# EAGLE design CDTV-RAM-IDE-V0.5 (EAGLE 6.6.0)

## Sheet 1 of 2
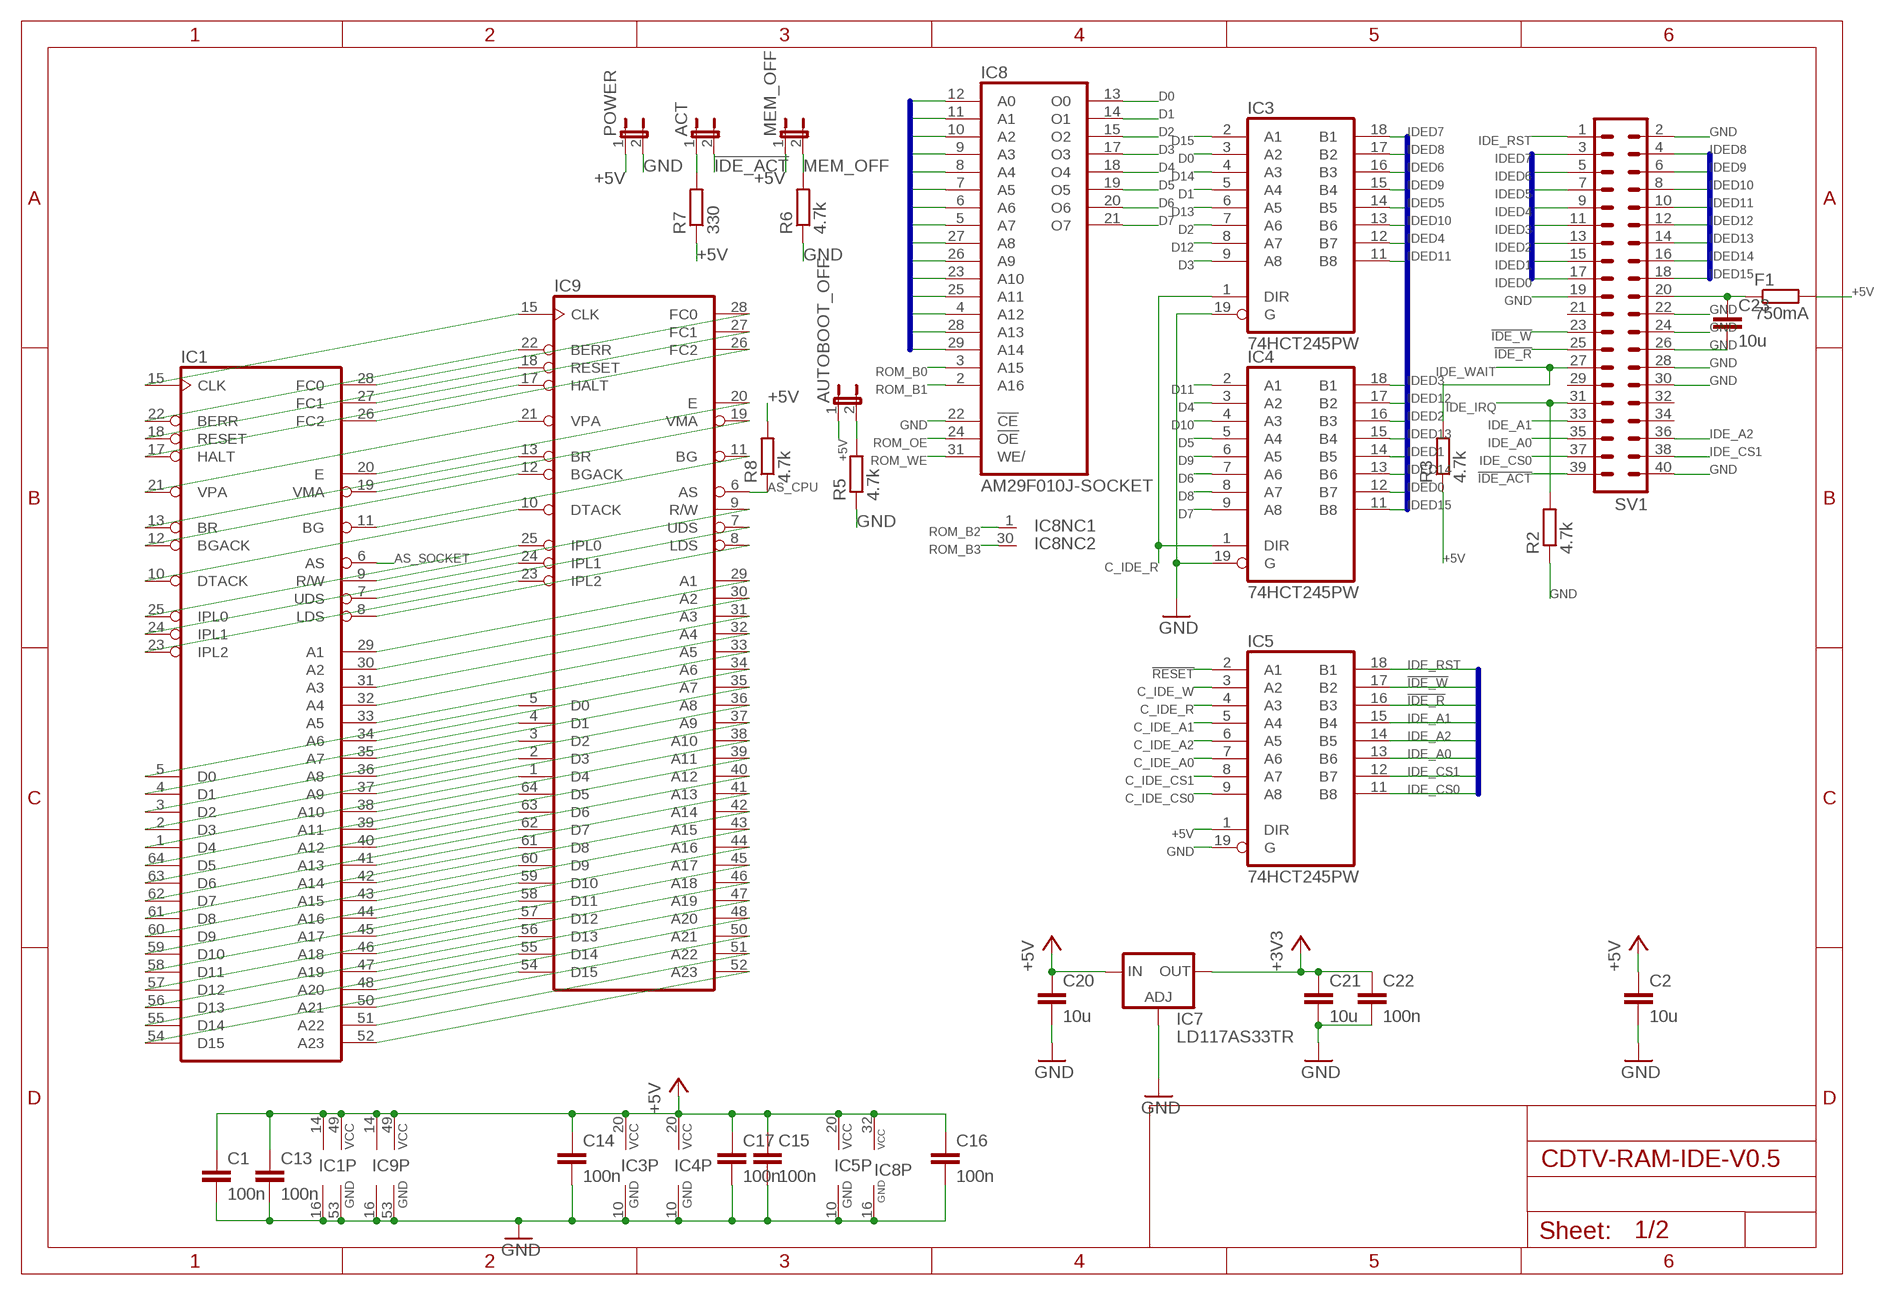
[diagram p0: schematic, sheet 1]

### Parts
ACT  JP1E  [JP1]
AUTOBOOT_OFF  JP1E  [JP1]
C1  100n  C-EUC0603K  [C0603K]
C2  10u  C-EUC0805K  [C0805K]
C13  100n  C-EUC0603K  [C0603K]
C14  100n  C-EUC0603K  [C0603K]
C15  100n  C-EUC0603K  [C0603K]
C16  100n  C-EUC0603K  [C0603K]
C17  100n  C-EUC0603K  [C0603K]
C20  10u  C-EUC0805K  [C0805K]
C21  10u  C-EUC0805K  [C0805K]
C22  100n  C-EUC0603K  [C0603K]
C23  10u  C-EUC0805K  [C0805K]
F1  750mA  R-EU_R2512  [R2512]
IC1  MC68000PROUND-PAD-BIG-HOLE  [DIL64-ROUND-BIGHOLE]
IC3  74HCT245PW  [TSSOP20]
IC4  74HCT245PW  [TSSOP20]
IC5  74HCT245PW  [TSSOP20]
IC7  LD117AS33TR  [SOT223]
IC8  AM29F010J-SOCKET  [PLCC-32-SMT-TT]
IC9  MC68000PROUND-PAD-BIG-HOLE  [DIL64-ROUND-BIGHOLE]
MEM_OFF  JP1E  [JP1]
POWER  JP1E  [JP1]
R2  4.7k  R-EU_R0603  [R0603]
R3  4.7k  R-EU_R0603  [R0603]
R5  4.7k  R-EU_R0603  [R0603]
R6  4.7k  R-EU_R0603  [R0603]
R7  330  R-EU_R0603  [R0603]
R8  4.7k  R-EU_R0603  [R0603]
SV1  ML40  [ML40]

### Nets
!BERR: IC1.22(BERR) IC9.22(BERR) ; also sheet 2
!BG: IC1.11(BG) IC9.11(BG)
!BGACK: IC1.12(BGACK) IC9.12(BGACK) ; also sheet 2
!BR: IC1.13(BR) IC9.13(BR)
!DTACK: IC1.10(DTACK) IC9.10(DTACK) ; also sheet 2
!HALT: IC1.17(HALT) IC9.17(HALT)
!IDE_ACT: ACT.2 SV1.39
!IDE_R: IC5.16(B3) SV1.25
!IDE_W: IC5.17(B2) SV1.23
!LDS: IC1.8(LDS) IC9.8(LDS) ; also sheet 2
!RESET: IC1.18(RESET) IC5.2(A1) IC9.18(RESET) ; also sheet 2
!UDS: IC1.7(UDS) IC9.7(UDS) ; also sheet 2
+3V3: C21.1 C22.1 IC7.2(OUT) IC7.4(OUT) ; also sheet 2
+5V: AUTOBOOT_OFF.1 C1.1 C2.1 C13.1 C14.1 C15.1 C16.1 C17.1 C20.1 F1.2 IC1.14(VCC) IC1.49(VCC) IC3.20(VCC) IC4.20(VCC) IC5.1(DIR) IC5.20(VCC) IC7.3(IN) IC8.32(VCC) IC9.14(VCC) IC9.49(VCC) MEM_OFF.1 POWER.1 R3.1 R7.1 R8.2 ; also sheet 2
A1: IC1.29(A1) IC8.12(A0) IC9.29(A1) ; also sheet 2
A2: IC1.30(A2) IC8.11(A1) IC9.30(A2) ; also sheet 2
A3: IC1.31(A3) IC8.10(A2) IC9.31(A3) ; also sheet 2
A4: IC1.32(A4) IC8.9(A3) IC9.32(A4) ; also sheet 2
A5: IC1.33(A5) IC8.8(A4) IC9.33(A5) ; also sheet 2
A6: IC1.34(A6) IC8.7(A5) IC9.34(A6) ; also sheet 2
A7: IC1.35(A7) IC8.6(A6) IC9.35(A7) ; also sheet 2
A8: IC1.36(A8) IC8.5(A7) IC9.36(A8) ; also sheet 2
A9: IC1.37(A9) IC8.27(A8) IC9.37(A9) ; also sheet 2
A10: IC1.38(A10) IC8.26(A9) IC9.38(A10) ; also sheet 2
A11: IC1.39(A11) IC8.23(A10) IC9.39(A11) ; also sheet 2
A12: IC1.40(A12) IC8.25(A11) IC9.40(A12) ; also sheet 2
A13: IC1.41(A13) IC8.4(A12) IC9.41(A13) ; also sheet 2
A14: IC1.42(A14) IC8.28(A13) IC9.42(A14) ; also sheet 2
A15: IC1.43(A15) IC8.29(A14) IC9.43(A15) ; also sheet 2
A16: IC1.44(A16) IC9.44(A16) ; also sheet 2
A17: IC1.45(A17) IC9.45(A17) ; also sheet 2
A18: IC1.46(A18) IC9.46(A18) ; also sheet 2
A19: IC1.47(A19) IC9.47(A19) ; also sheet 2
A20: IC1.48(A20) IC9.48(A20) ; also sheet 2
A21: IC1.50(A21) IC9.50(A21) ; also sheet 2
A22: IC1.51(A22) IC9.51(A22) ; also sheet 2
A23: IC1.52(A23) IC9.52(A23) ; also sheet 2
AS_CPU: IC9.6(AS) R8.1 ; also sheet 2
AS_SOCKET: IC1.6(AS) ; also sheet 2
AUTO_BOOT_OFF: AUTOBOOT_OFF.2 R5.2 ; also sheet 2
C_IDE_A0: IC5.7(A6) ; also sheet 2
C_IDE_A1: IC5.5(A4) ; also sheet 2
C_IDE_A2: IC5.6(A5) ; also sheet 2
C_IDE_CS0: IC5.9(A8) ; also sheet 2
C_IDE_CS1: IC5.8(A7) ; also sheet 2
C_IDE_R: IC3.1(DIR) IC4.1(DIR) IC5.4(A3) ; also sheet 2
C_IDE_W: IC5.3(A2) ; also sheet 2
CLK: IC1.15(CLK) IC9.15(CLK) ; also sheet 2
D0: IC1.5(D0) IC3.3(A2) IC8.13(O0) IC9.5(D0) ; also sheet 2
D1: IC1.4(D1) IC3.5(A4) IC8.14(O1) IC9.4(D1) ; also sheet 2
D2: IC1.3(D2) IC3.7(A6) IC8.15(O2) IC9.3(D2) ; also sheet 2
D3: IC1.2(D3) IC3.9(A8) IC8.17(O3) IC9.2(D3) ; also sheet 2
D4: IC1.1(D4) IC4.3(A2) IC8.18(O4) IC9.1(D4) ; also sheet 2
D5: IC1.64(D5) IC4.5(A4) IC8.19(O5) IC9.64(D5) ; also sheet 2
D6: IC1.63(D6) IC4.7(A6) IC8.20(O6) IC9.63(D6) ; also sheet 2
D7: IC1.62(D7) IC4.9(A8) IC8.21(O7) IC9.62(D7) ; also sheet 2
D8: IC1.61(D8) IC4.8(A7) IC9.61(D8) ; also sheet 2
D9: IC1.60(D9) IC4.6(A5) IC9.60(D9) ; also sheet 2
D10: IC1.59(D10) IC4.4(A3) IC9.59(D10) ; also sheet 2
D11: IC1.58(D11) IC4.2(A1) IC9.58(D11) ; also sheet 2
D12: IC1.57(D12) IC3.8(A7) IC9.57(D12) ; also sheet 2
D13: IC1.56(D13) IC3.6(A5) IC9.56(D13) ; also sheet 2
D14: IC1.55(D14) IC3.4(A3) IC9.55(D14) ; also sheet 2
D15: IC1.54(D15) IC3.2(A1) IC9.54(D15) ; also sheet 2
E: IC1.20(E) IC9.20(E)
FC0: IC1.28(FC0) IC9.28(FC0)
FC1: IC1.27(FC1) IC9.27(FC1)
FC2: IC1.26(FC2) IC9.26(FC2)
GND: C1.2 C2.2 C13.2 C14.2 C15.2 C16.2 C17.2 C20.2 C21.2 C22.2 C23.2 IC1.16(GND) IC1.53(GND) IC3.10(GND) IC3.19(G) IC4.10(GND) IC4.19(G) IC5.10(GND) IC5.19(G) IC7.1(ADJ) IC8.16(GND) IC8.22(!CE) IC9.16(GND) IC9.53(GND) POWER.2 R2.1 R5.1 R6.1 SV1.2 SV1.19 SV1.22 SV1.24 SV1.26 SV1.28 SV1.30 SV1.40 ; also sheet 2
IDE_A0: IC5.13(B6) SV1.35
IDE_A1: IC5.15(B4) SV1.33
IDE_A2: IC5.14(B5) SV1.36
IDE_CS0: IC5.11(B8) SV1.37
IDE_CS1: IC5.12(B7) SV1.38
IDE_IRQ: R2.2 SV1.31 ; also sheet 2
IDE_RST: IC5.18(B1) SV1.1
IDE_WAIT: R3.2 SV1.27 ; also sheet 2
IDED0: IC4.12(B7) SV1.17
IDED1: IC4.14(B5) SV1.15
IDED2: IC4.16(B3) SV1.13
IDED3: IC4.18(B1) SV1.11
IDED4: IC3.12(B7) SV1.9
IDED5: IC3.14(B5) SV1.7
IDED6: IC3.16(B3) SV1.5
IDED7: IC3.18(B1) SV1.3
IDED8: IC3.17(B2) SV1.4
IDED9: IC3.15(B4) SV1.6
IDED10: IC3.13(B6) SV1.8
IDED11: IC3.11(B8) SV1.10
IDED12: IC4.17(B2) SV1.12
IDED13: IC4.15(B4) SV1.14
IDED14: IC4.13(B6) SV1.16
IDED15: IC4.11(B8) SV1.18
IPL0: IC1.25(IPL0) IC9.25(IPL0)
IPL1: IC1.24(IPL1) IC9.24(IPL1)
IPL2: IC1.23(IPL2) IC9.23(IPL2)
KEY_PIN_POWER: C23.1 F1.1 SV1.20
MEM_OFF: MEM_OFF.2 R6.2 ; also sheet 2
N$42: ACT.1 R7.2
R/W: IC1.9(R/W) IC9.9(R/W) ; also sheet 2
ROM_B0: IC8.3(A15) ; also sheet 2
ROM_B1: IC8.2(A16) ; also sheet 2
ROM_B2: IC8.1(NC) ; also sheet 2
ROM_B3: IC8.30(NC) ; also sheet 2
ROM_OE: IC8.24(!OE) ; also sheet 2
ROM_WE: IC8.31(WE/) ; also sheet 2
VMA: IC1.19(VMA) IC9.19(VMA)
VPA: IC1.21(VPA) IC9.21(VPA)
Unconnected: SV1.21 SV1.29 SV1.32 SV1.34

### Buses
IDED[0..15]
IDE_RST,IDE_A[0..2],IDE_CS[0..1],!IDE_R,!IDE_W
A[1..23]

## Sheet 2 of 2
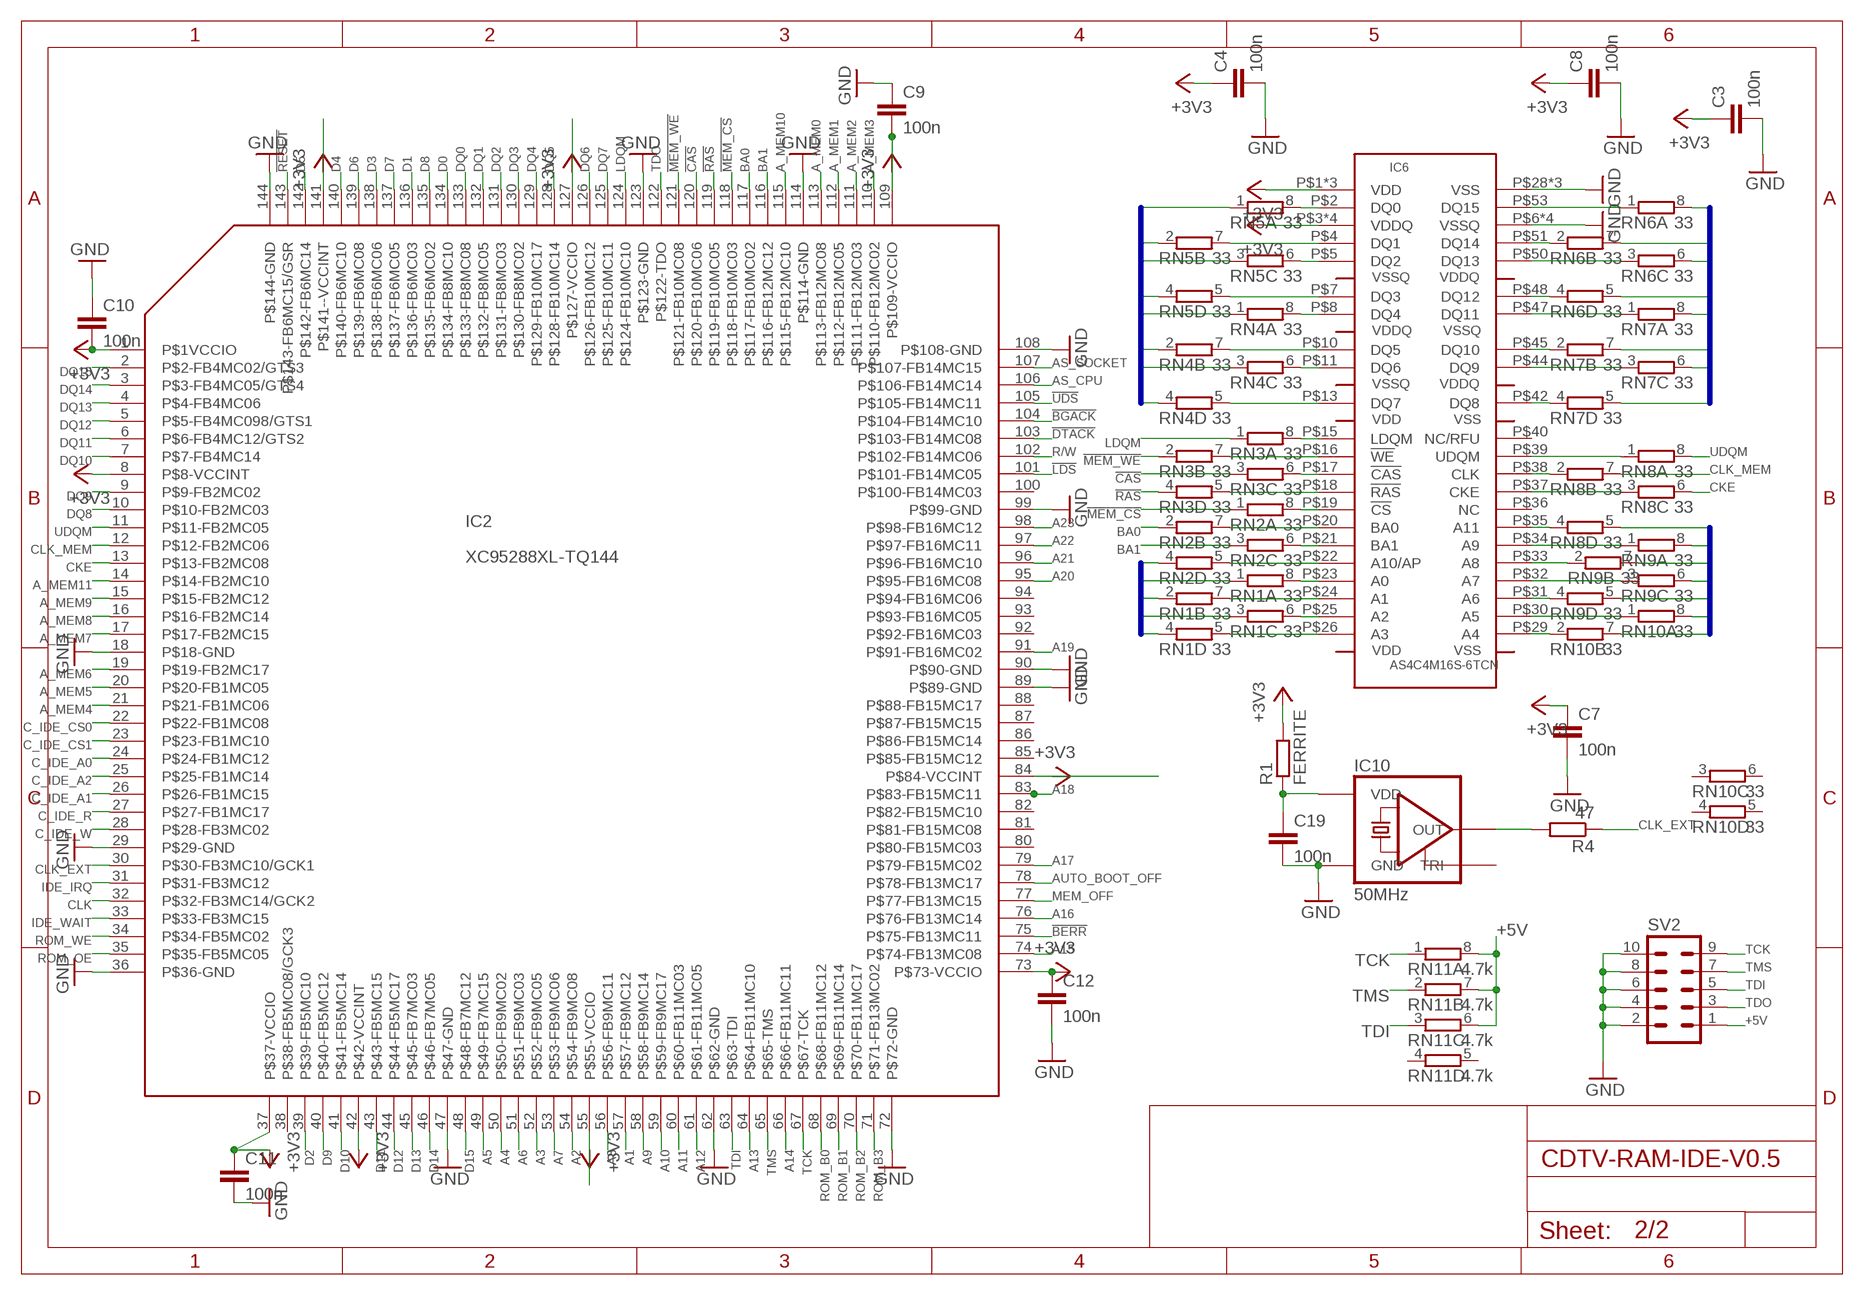
[diagram p1: schematic, sheet 2]

### Parts
C3  100n  C-EUC0603K  [C0603K]
C4  100n  C-EUC0603K  [C0603K]
C7  100n  C-EUC0603K  [C0603K]
C8  100n  C-EUC0603K  [C0603K]
C9  100n  C-EUC0603K  [C0603K]
C10  100n  C-EUC0603K  [C0603K]
C11  100n  C-EUC0603K  [C0603K]
C12  100n  C-EUC0603K  [C0603K]
C19  100n  C-EUC0603K  [C0603K]
IC2  XC95288XL-TQ144  [TQFP144]
IC6  AS4C4M16S-6TCN  [TSOP-2_54]
IC10  50MHz  CSX-750FCFC(5V)  [7X5]
R1  FERRITE  R-EU_R0603  [R0603]
R4  47  R-EU_R0603  [R0603]
RN1  33  4R-NCAY16  [CAY16]
RN2  33  4R-NCAY16  [CAY16]
RN3  33  4R-NCAY16  [CAY16]
RN4  33  4R-NCAY16  [CAY16]
RN5  33  4R-NCAY16  [CAY16]
RN6  33  4R-NCAY16  [CAY16]
RN7  33  4R-NCAY16  [CAY16]
RN8  33  4R-NCAY16  [CAY16]
RN9  33  4R-NCAY16  [CAY16]
RN10  33  4R-NCAY16  [CAY16]
RN11  4.7k  4R-NCAY16  [CAY16]
SV2  ML10L  [ML10L]

### Nets
!BERR: IC2.75(P$75-FB13MC11) ; also sheet 1
!BGACK: IC2.104(P$104-FB14MC10) ; also sheet 1
!CAS: IC2.120(P$120-FB10MC06) RN3.3
!DTACK: IC2.103(P$103-FB14MC08) ; also sheet 1
!LDS: IC2.101(P$101-FB14MC05) ; also sheet 1
!MEM_CS: IC2.118(P$118-FB10MC03) RN2.1
!MEM_WE: IC2.121(P$121-FB10MC08) RN3.2
!RAS: IC2.119(P$119-FB10MC05) RN3.4
!RESET: IC2.143(P$143-FB6MC15/GSR) ; also sheet 1
!UDS: IC2.105(P$105-FB14MC11) ; also sheet 1
+3V3: C3.1 C4.1 C7.1 C8.1 C9.2 C10.2 C11.1 C12.1 IC2.1(P$1VCCIO) IC2.8(P$8-VCCINT) IC2.37(P$37-VCCIO) IC2.42(P$42-VCCINT) IC2.55(P$55-VCCIO) IC2.73(P$73-VCCIO) IC2.84(P$84-VCCINT) IC2.109(P$109-VCCIO) IC2.127(P$127-VCCIO) IC2.141(P$141--VCCINT) IC6.P$1(VDD) IC6.P$3(VDDQ) IC6.P$9(VDDQ) IC6.P$14(VDD) IC6.P$27(VDD) IC6.P$43(VDDQ) IC6.P$49(VDDQ) R1.2 ; also sheet 1
+5V: RN11.6 RN11.7 RN11.8 SV2.1 ; also sheet 1
A1: IC2.57(P$57-FB9MC12) ; also sheet 1
A2: IC2.54(P$54-FB9MC08) ; also sheet 1
A3: IC2.52(P$52-FB9MC05) ; also sheet 1
A4: IC2.50(P$50-FB9MC02) ; also sheet 1
A5: IC2.49(P$49-FB7MC15) ; also sheet 1
A6: IC2.51(P$51-FB9MC03) ; also sheet 1
A7: IC2.53(P$53-FB9MC06) ; also sheet 1
A8: IC2.56(P$56-FB9MC11) ; also sheet 1
A9: IC2.58(P$58-FB9MC14) ; also sheet 1
A10: IC2.59(P$59-FB9MC17) ; also sheet 1
A11: IC2.60(P$60-FB11MC03) ; also sheet 1
A12: IC2.61(P$61-FB11MC05) ; also sheet 1
A13: IC2.64(P$64-FB11MC10) ; also sheet 1
A14: IC2.66(P$66-FB11MC11) ; also sheet 1
A15: IC2.74(P$74-FB13MC08) ; also sheet 1
A16: IC2.76(P$76-FB13MC14) ; also sheet 1
A17: IC2.79(P$79-FB15MC02) ; also sheet 1
A18: IC2.83(P$83-FB15MC11) ; also sheet 1
A19: IC2.91(P$91-FB16MC02) ; also sheet 1
A20: IC2.95(P$95-FB16MC08) ; also sheet 1
A21: IC2.96(P$96-FB16MC10) ; also sheet 1
A22: IC2.97(P$97-FB16MC11) ; also sheet 1
A23: IC2.98(P$98-FB16MC12) ; also sheet 1
A_MEM0: IC2.113(P$113-FB12MC08) RN1.1
A_MEM1: IC2.112(P$112-FB12MC05) RN1.2
A_MEM2: IC2.111(P$111-FB12MC03) RN1.3
A_MEM3: IC2.110(P$110-FB12MC02) RN1.4
A_MEM4: IC2.21(P$21-FB1MC06) RN10.7
A_MEM5: IC2.20(P$20-FB1MC05) RN10.8
A_MEM6: IC2.19(P$19-FB2MC17) RN9.5
A_MEM7: IC2.17(P$17-FB2MC15) RN9.6
A_MEM8: IC2.16(P$16-FB2MC14) RN9.7
A_MEM9: IC2.15(P$15-FB2MC12) RN9.8
A_MEM10: IC2.115(P$115-FB12MC10) RN2.4
A_MEM11: IC2.14(P$14-FB2MC10) RN8.5
AS_CPU: IC2.106(P$106-FB14MC14) ; also sheet 1
AS_SOCKET: IC2.107(P$107-FB14MC15) ; also sheet 1
AUTO_BOOT_OFF: IC2.78(P$78-FB13MC17) ; also sheet 1
BA0: IC2.117(P$117-FB10MC02) RN2.2
BA1: IC2.116(P$116-FB12MC12) RN2.3
C_IDE_A0: IC2.24(P$24-FB1MC12) ; also sheet 1
C_IDE_A1: IC2.26(P$26-FB1MC15) ; also sheet 1
C_IDE_A2: IC2.25(P$25-FB1MC14) ; also sheet 1
C_IDE_CS0: IC2.22(P$22-FB1MC08) ; also sheet 1
C_IDE_CS1: IC2.23(P$23-FB1MC10) ; also sheet 1
C_IDE_R: IC2.27(P$27-FB1MC17) ; also sheet 1
C_IDE_W: IC2.28(P$28-FB3MC02) ; also sheet 1
CKE: IC2.13(P$13-FB2MC08) RN8.6
CLK: IC2.32(P$32-FB3MC14/GCK2) ; also sheet 1
CLK_EXT: IC2.30(P$30-FB3MC10/GCK1) R4.1
CLK_MEM: IC2.12(P$12-FB2MC06) RN8.7
D0: IC2.134(P$134-FB8MC10) ; also sheet 1
D1: IC2.136(P$136-FB6MC03) ; also sheet 1
D2: IC2.39(P$39-FB5MC10) ; also sheet 1
D3: IC2.138(P$138-FB6MC06) ; also sheet 1
D4: IC2.140(P$140-FB6MC10) ; also sheet 1
D5: IC2.142(P$142-FB6MC14) ; also sheet 1
D6: IC2.139(P$139-FB6MC08) ; also sheet 1
D7: IC2.137(P$137-FB6MC05) ; also sheet 1
D8: IC2.135(P$135-FB6MC02) ; also sheet 1
D9: IC2.40(P$40-FB5MC12) ; also sheet 1
D10: IC2.41(P$41-FB5MC14) ; also sheet 1
D11: IC2.43(P$43-FB5MC15) ; also sheet 1
D12: IC2.44(P$44-FB5MC17) ; also sheet 1
D13: IC2.45(P$45-FB7MC03) ; also sheet 1
D14: IC2.46(P$46-FB7MC05) ; also sheet 1
D15: IC2.48(P$48-FB7MC12) ; also sheet 1
DQ0: IC2.133(P$133-FB8MC08) RN5.1
DQ1: IC2.132(P$132-FB8MC05) RN5.2
DQ2: IC2.131(P$131-FB8MC03) RN5.3
DQ3: IC2.130(P$130-FB8MC02) RN5.4
DQ4: IC2.129(P$129-FB10MC17) RN4.1
DQ5: IC2.128(P$128-FB10MC14) RN4.2
DQ6: IC2.126(P$126-FB10MC12) RN4.3
DQ7: IC2.125(P$125-FB10MC11) RN4.4
DQ8: IC2.10(P$10-FB2MC03) RN7.5
DQ9: IC2.9(P$9-FB2MC02) RN7.6
DQ10: IC2.7(P$7-FB4MC14) RN7.7
DQ11: IC2.6(P$6-FB4MC12/GTS2) RN7.8
DQ12: IC2.5(P$5-FB4MC098/GTS1) RN6.5
DQ13: IC2.4(P$4-FB4MC06) RN6.6
DQ14: IC2.3(P$3-FB4MC05/GTS4) RN6.7
DQ15: IC2.2(P$2-FB4MC02/GTS3) RN6.8
GND: C3.2 C4.2 C7.2 C8.2 C9.1 C10.1 C11.2 C12.2 C19.2 IC2.18(P$18-GND) IC2.29(P$29-GND) IC2.36(P$36-GND) IC2.47(P$47-GND) IC2.62(P$62-GND) IC2.72(P$72-GND) IC2.89(P$89-GND) IC2.90(P$90-GND) IC2.99(P$99-GND) IC2.108(P$108-GND) IC2.114(P$114-GND) IC2.123(P$123-GND) IC2.144(P$144-GND) IC6.P$6(VSSQ) IC6.P$12(VSSQ) IC6.P$28(VSS) IC6.P$41(VSS) IC6.P$46(VSSQ) IC6.P$52(VSSQ) IC6.P$54(VSS) IC10.P$2(GND) SV2.2 SV2.4 SV2.6 SV2.8 SV2.10 ; also sheet 1
IDE_IRQ: IC2.31(P$31-FB3MC12) ; also sheet 1
IDE_WAIT: IC2.33(P$33-FB3MC15) ; also sheet 1
LDQM: IC2.124(P$124-FB10MC10) RN3.1
MEM_OFF: IC2.77(P$77-FB13MC15) ; also sheet 1
N$1: IC6.P$26(A3) RN1.5
N$2: IC6.P$25(A2) RN1.6
N$3: IC6.P$24(A1) RN1.7
N$4: IC6.P$23(A0) RN1.8
N$5: IC6.P$22(A10/AP) RN2.5
N$6: IC6.P$21(BA1) RN2.6
N$7: IC6.P$20(BA0) RN2.7
N$8: IC6.P$19(!CS) RN2.8
N$9: IC6.P$18(!RAS) RN3.5
N$10: IC6.P$17(!CAS) RN3.6
N$11: IC6.P$16(!WE) RN3.7
N$12: IC6.P$15(LDQM) RN3.8
N$13: IC6.P$13(DQ7) RN4.5
N$14: IC6.P$11(DQ6) RN4.6
N$15: IC6.P$10(DQ5) RN4.7
N$16: IC6.P$8(DQ4) RN4.8
N$17: IC6.P$7(DQ3) RN5.5
N$18: IC6.P$5(DQ2) RN5.6
N$19: IC6.P$4(DQ1) RN5.7
N$20: IC6.P$2(DQ0) RN5.8
N$21: IC6.P$53(DQ15) RN6.1
N$22: IC6.P$51(DQ14) RN6.2
N$23: IC6.P$50(DQ13) RN6.3
N$24: IC6.P$48(DQ12) RN6.4
N$25: IC6.P$47(DQ11) RN7.1
N$26: IC6.P$45(DQ10) RN7.2
N$27: IC6.P$44(DQ9) RN7.3
N$28: IC6.P$42(DQ8) RN7.4
N$29: IC6.P$39(UDQM) RN8.1
N$30: IC6.P$38(CLK) RN8.2
N$31: IC6.P$37(CKE) RN8.3
N$32: IC6.P$35(A11) RN8.4
N$33: IC6.P$34(A9) RN9.1
N$34: IC6.P$33(A8) RN9.2
N$35: IC6.P$32(A7) RN9.3
N$36: IC6.P$31(A6) RN9.4
N$37: IC6.P$30(A5) RN10.1
N$38: IC6.P$29(A4) RN10.2
N$39: IC10.P$3(OUT) R4.2
R/W: IC2.102(P$102-FB14MC06) ; also sheet 1
ROM_B0: IC2.68(P$68-FB11MC12) ; also sheet 1
ROM_B1: IC2.69(P$69-FB11MC14) ; also sheet 1
ROM_B2: IC2.70(P$70-FB11MC17) ; also sheet 1
ROM_B3: IC2.71(P$71-FB13MC02) ; also sheet 1
ROM_OE: IC2.35(P$35-FB5MC05) ; also sheet 1
ROM_WE: IC2.34(P$34-FB5MC02) ; also sheet 1
TCK: IC2.67(P$67-TCK) RN11.1 SV2.9
TDI: IC2.63(P$63-TDI) RN11.3 SV2.5
TDO: IC2.122(P$122-TDO) SV2.3
TMS: IC2.65(P$65-TMS) RN11.2 SV2.7
UDQM: IC2.11(P$11-FB2MC05) RN8.8
VCC-X: C19.1 IC10.P$4(VDD) R1.1
Unconnected: IC2.38(P$38-FB5MC08/GCK3) IC2.80(P$80-FB15MC03) IC2.81(P$81-FB15MC08) IC2.82(P$82-FB15MC10) IC2.85(P$85-FB15MC12) IC2.86(P$86-FB15MC14) IC2.87(P$87-FB15MC15) IC2.88(P$88-FB15MC17) IC2.92(P$92-FB16MC03) IC2.93(P$93-FB16MC05) IC2.94(P$94-FB16MC06) IC2.100(P$100-FB14MC03) IC6.P$36(NC) IC6.P$40(NC/RFU) IC10.P$1(TRI) RN10.3 RN10.4 RN10.5 RN10.6 RN11.4 RN11.5

### Buses
DQ[0..15]
A_MEM[0..11]

## Library data of the parts
ACT AUTOBOOT_OFF MEM_OFF POWER = jumper:JP1E: JUMPER
C1-C4 C7-C17 C19-C23 = rcl:C-EU: CAPACITOR, European symbol
F1 R1-R8 = rcl:R-EU_: RESISTOR, European symbol
IC1 IC9 = micro-mc68000:MC68000P: 68xxx PROCESSOR
IC2 = xilinx_xc9572xl-tq100:XC95288XL-TQ144
IC3-IC5 = 74xx-eu:74*245: Octal BUS TRANSCEIVER, 3-state
IC6 = Alliance_Memory_By_element14_Batch_1:AS4C4M16S-6TCN
IC7 = v-reg:LD117A?*: Low drop fixed and adjustable positive voltage regulators 1 A Source: http://www.st.com/stonline/products/literature/ds/7194/ld1117axx.pdf
IC8 = am29-memory:AM29F010*: 1-Megabit FLASH MEMORY (128 K x 8 bit) 5 V-only
IC10 = SMD-Crystal:CSX-750FC: CITIZEN Crystal Clock Oscilator from http://cfm.citizen.co.jp/english/product/pdf/CSX-750F.pdf
RN1-RN11 = resistor-dil:4R-N: Array Chip Resistor Source: RS Component / Phycomp; OC_FARNELL: unknown; OC_NEWARK: unknown
SV1 = con-harting-ml:ML40: HARTING; OC_FARNELL: unknown; OC_NEWARK: unknown
SV2 = con-harting-ml:ML10: HARTING; OC_FARNELL: unknown; OC_NEWARK: unknown

## Board
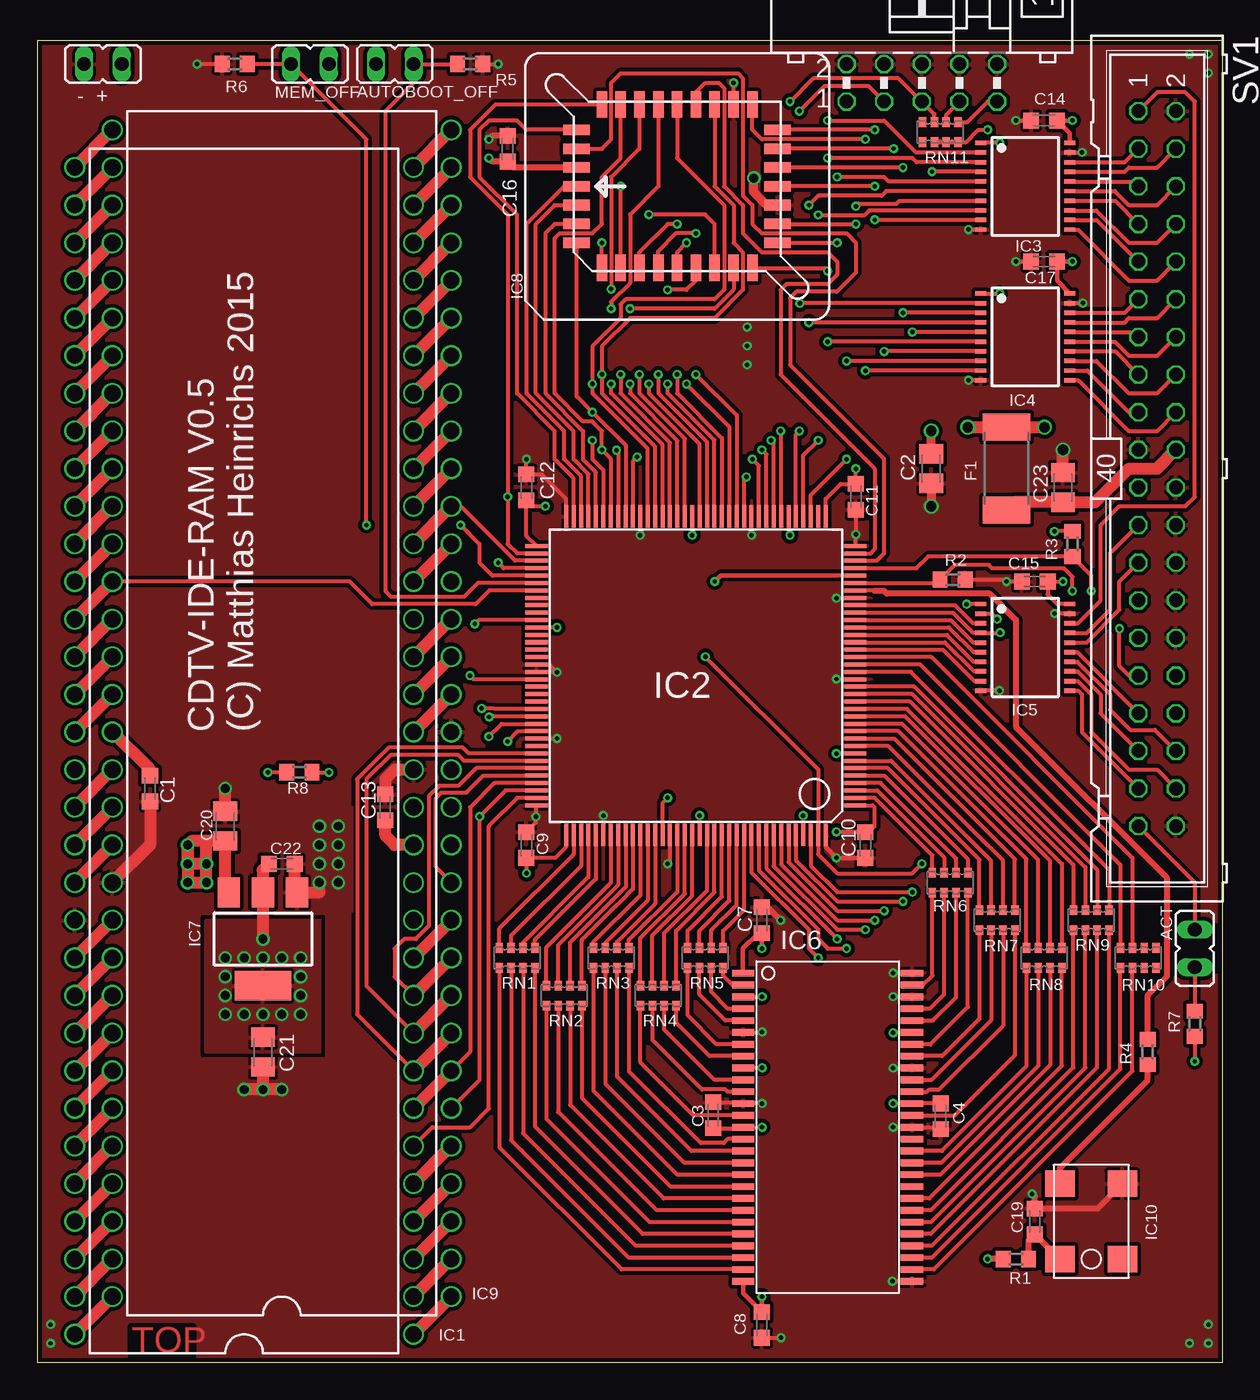
[diagram p2: board, top side]
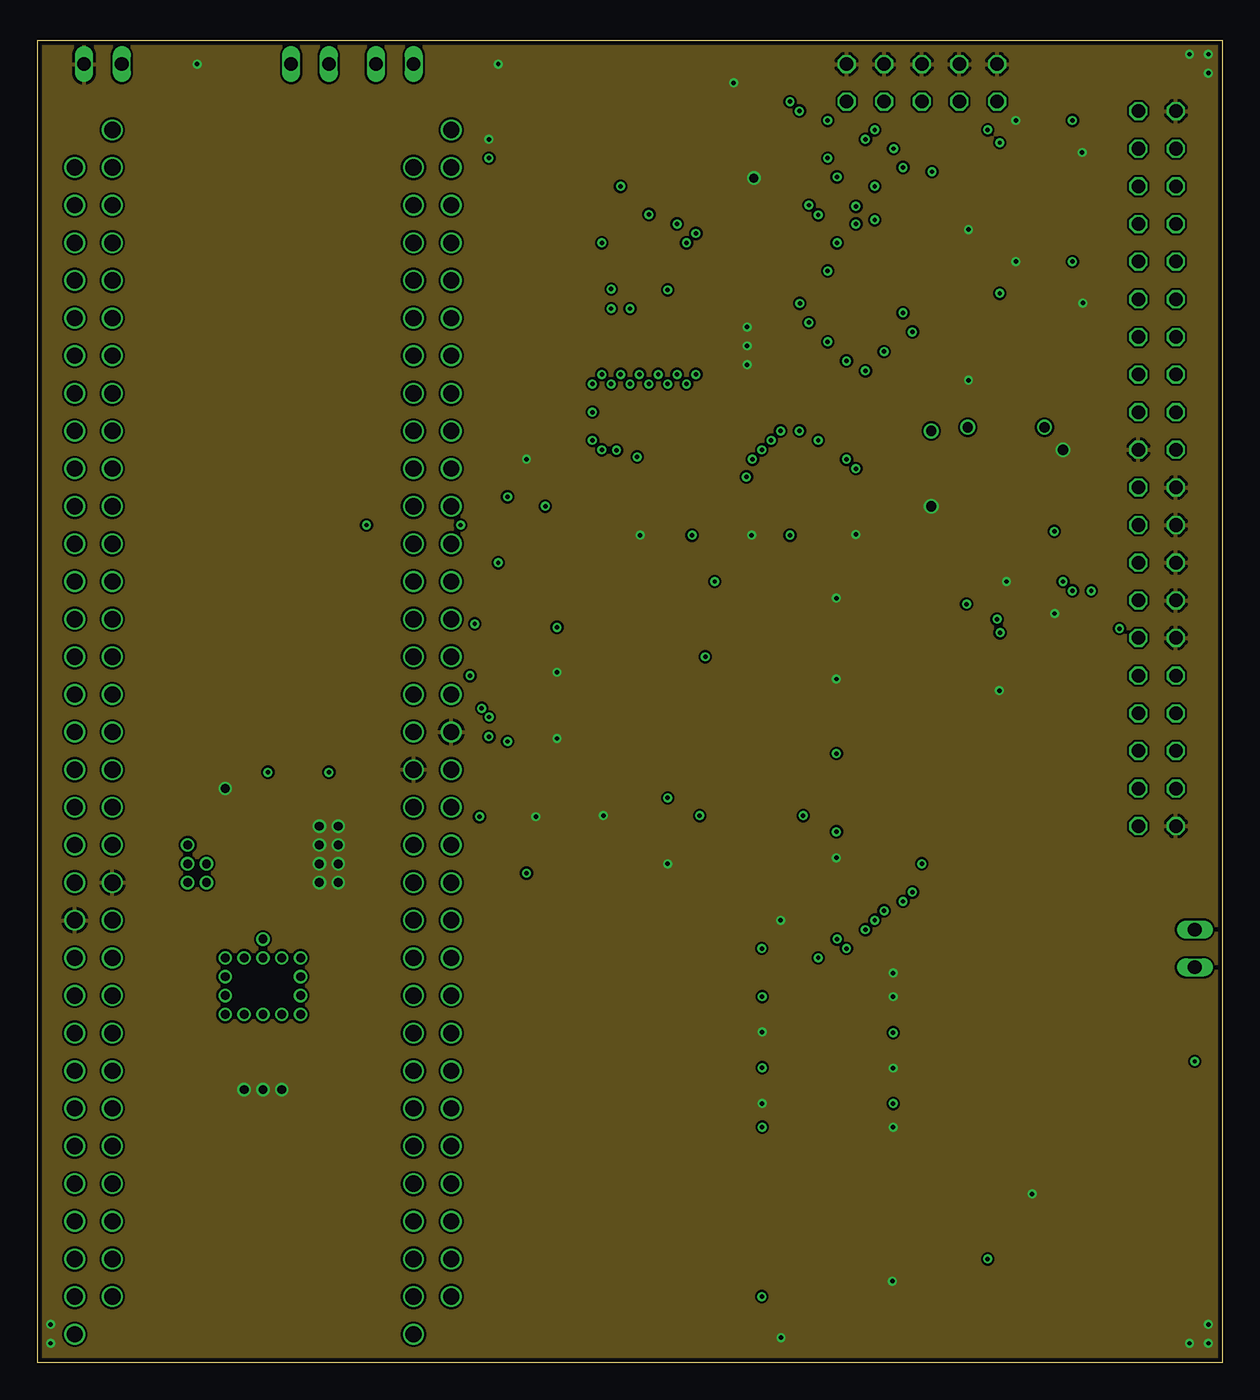
[diagram p3: board, inner layer Route2]
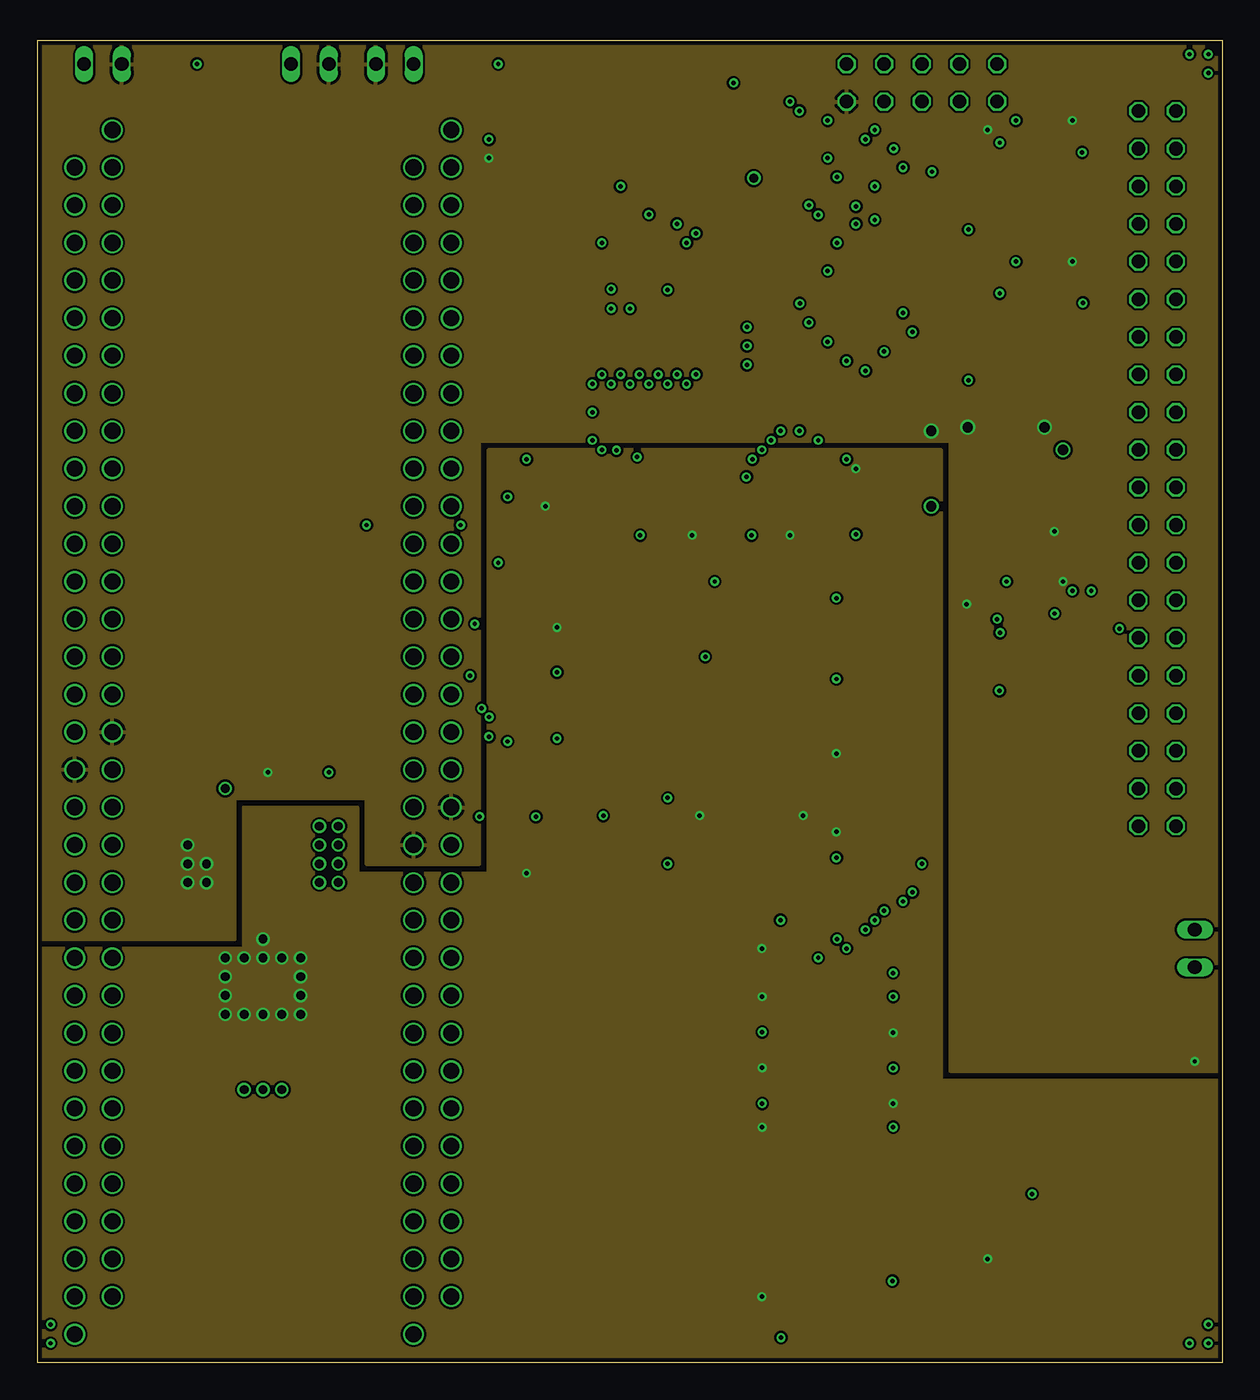
[diagram p4: board, inner layer Route15]
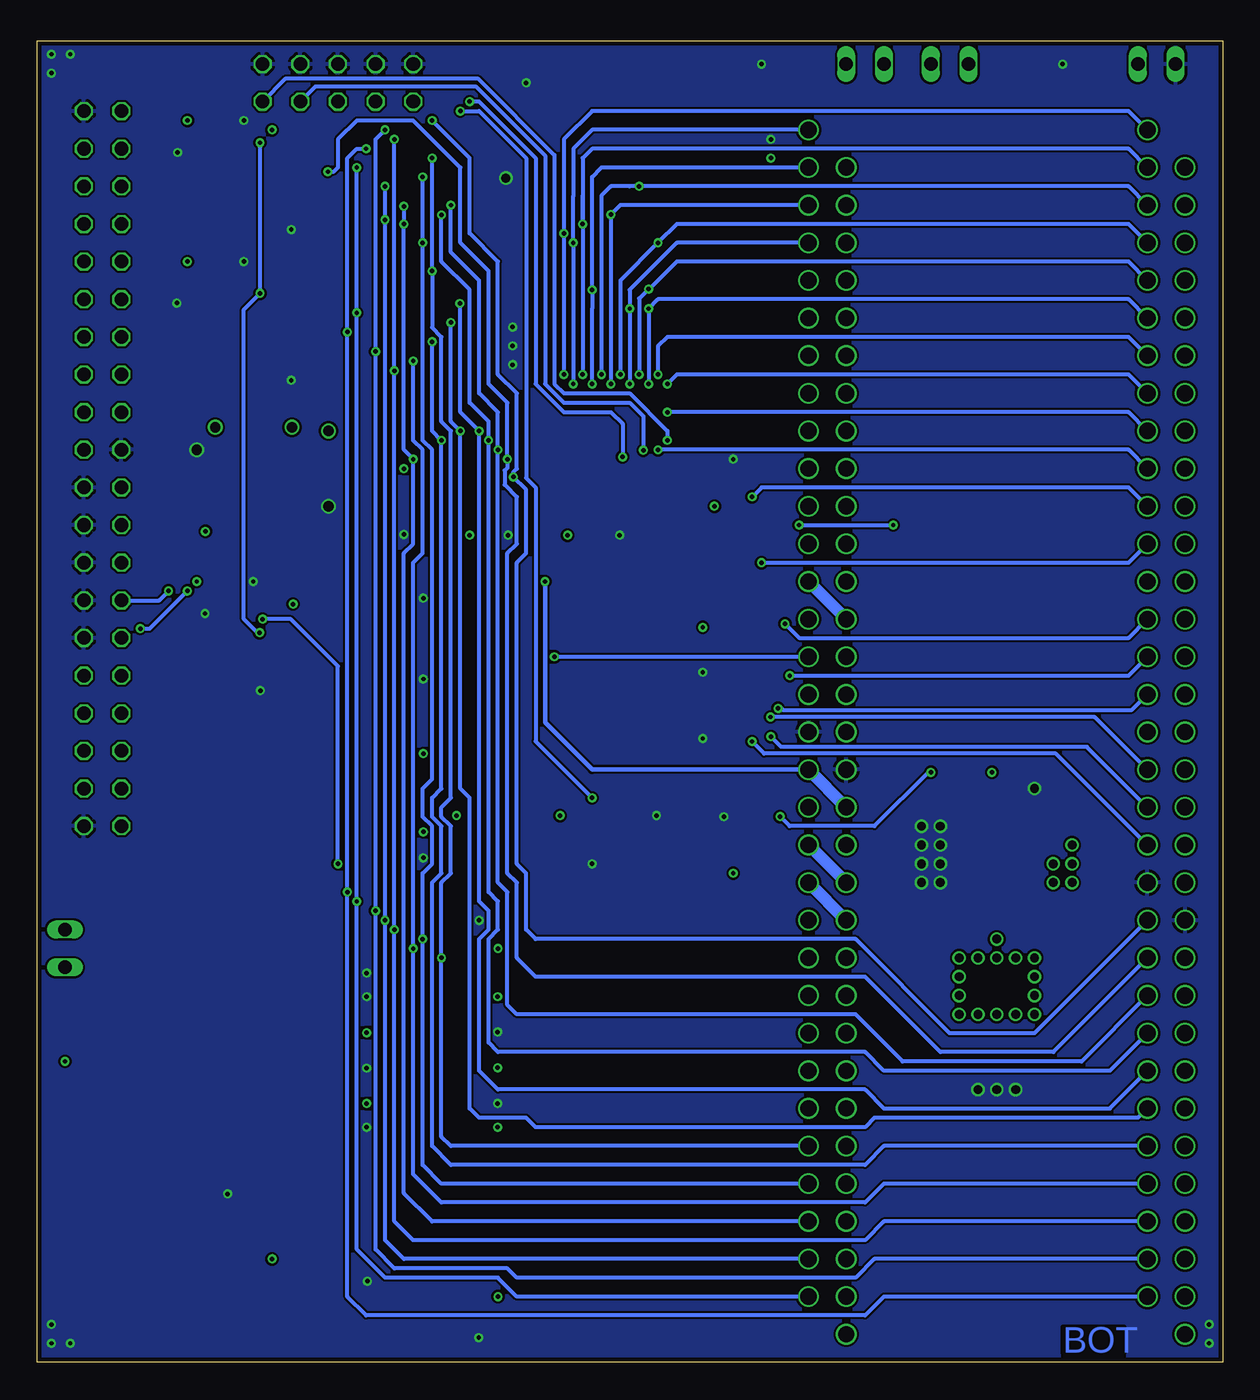
[diagram p5: board, bottom side, seen from below]

Size 79.99 x 89.2 mm. Coordinates in mm from the lower left corner, seen from the top.
Outline: 0,0 79.99,0 79.99,89.2 0,89.2 0,0
Copper layers (1+2*15+16): Top 0.035mm / dielectric 0.36mm / Route2 0.035mm / dielectric 0.71mm / Route15 0.035mm / dielectric 0.36mm / Bottom 0.035mm
Design rules "LeitOn - Standard-Eagle-DRU - 4-Lagen Multilayer - deutsch - Rev 2.0 *": minimum track width 0.15mm, minimum drill 0.3mm, track to track 0.15mm, track to pad 0.15mm, pad to pad 0.15mm, via to via 0.15mm, smd to smd 0.15mm, copper to edge 0.3mm, drill to drill 0.3mm, minimum pad ring 0.15mm, minimum via ring 0.15mm, stop-mask expansion 0.075mm, vias tented up to drill 0mil, thermal gap 0.2mm

### Footprints (pad centres in the part's own frame; a part is rotated, then mirrored left to right if it is on the bottom)
JP1 = drill 0.914 long: 1 0,-1.27; 2 0,1.27
C0603K = smd 1.05 x 1.08: 1 -0.875,0; 2 0.875,0
C0805K = smd 1.3 x 1.6: 1 -1,0; 2 1,0
R2512 = smd 1.8 x 3.2: 1 -2.8,0; 2 2.8,0
DIL64-ROUND-BIGHOLE = drill 1.1: 1 -38.1,-11.43; 2 -35.56,-11.43; 3 -33.02,-11.43; 4 -30.48,-11.43; 5 -27.94,-11.43; 6 -25.4,-11.43; 7 -22.86,-11.43; 8 -20.32,-11.43; 9 -17.78,-11.43; 10 -15.24,-11.43; 11 -12.7,-11.43; 12 -10.16,-11.43; 13 -7.62,-11.43; 14 -5.08,-11.43; 15 -2.54,-11.43; 16 0,-11.43; 17 2.54,-11.43; 18 5.08,-11.43; 19 7.62,-11.43; 20 10.16,-11.43; 21 12.7,-11.43; 22 15.24,-11.43; 23 17.78,-11.43; 24 20.32,-11.43; 25 22.86,-11.43; 26 25.4,-11.43; 27 27.94,-11.43; 28 30.48,-11.43; 29 33.02,-11.43; 30 35.56,-11.43; 31 38.1,-11.43; 32 40.64,-11.43; 33 40.64,11.43; 34 38.1,11.43; 35 35.56,11.43; 36 33.02,11.43; 37 30.48,11.43; 38 27.94,11.43; 39 25.4,11.43; 40 22.86,11.43; 41 20.32,11.43; 42 17.78,11.43; 43 15.24,11.43; 44 12.7,11.43; 45 10.16,11.43; 46 7.62,11.43; 47 5.08,11.43; 48 2.54,11.43; 49 0,11.43; 50 -2.54,11.43; 51 -5.08,11.43; 52 -7.62,11.43; 53 -10.16,11.43; 54 -12.7,11.43; 55 -15.24,11.43; 56 -17.78,11.43; 57 -20.32,11.43; 58 -22.86,11.43; 59 -25.4,11.43; 60 -27.94,11.43; 61 -30.48,11.43; 62 -33.02,11.43; 63 -35.56,11.43; 64 -38.1,11.43
TQFP144 = smd 0.27 x 1.5: 1 -8.75,-10.75; 2 -8.25,-10.75; 3 -7.75,-10.75; 4 -7.25,-10.75; 5 -6.75,-10.75; 6 -6.25,-10.75; 7 -5.75,-10.75; 8 -5.25,-10.75; 9 -4.75,-10.75; 10 -4.25,-10.75; 11 -3.75,-10.75; 12 -3.25,-10.75; 13 -2.75,-10.75; 14 -2.25,-10.75; 15 -1.75,-10.75; 16 -1.25,-10.75; 17 -0.75,-10.75; 18 -0.25,-10.75; 19 0.25,-10.75; 20 0.75,-10.75; 21 1.25,-10.75; 22 1.75,-10.75; 23 2.25,-10.75; 24 2.75,-10.75; 25 3.25,-10.75; 26 3.75,-10.75; 27 4.25,-10.75; 28 4.75,-10.75; 29 5.25,-10.75; 30 5.75,-10.75; 31 6.25,-10.75; 32 6.75,-10.75; 33 7.25,-10.75; 34 7.75,-10.75; 35 8.25,-10.75; 36 8.75,-10.75; 73 8.75,10.75; 74 8.25,10.75; 75 7.75,10.75; 76 7.25,10.75; 77 6.75,10.75; 78 6.25,10.75; 79 5.75,10.75; 80 5.25,10.75; 81 4.75,10.75; 82 4.25,10.75; 83 3.75,10.75; 84 3.25,10.75; 85 2.75,10.75; 86 2.25,10.75; 87 1.75,10.75; 88 1.25,10.75; 89 0.75,10.75; 90 0.25,10.75; 91 -0.25,10.75; 92 -0.75,10.75; 93 -1.25,10.75; 94 -1.75,10.75; 95 -2.25,10.75; 96 -2.75,10.75; 97 -3.25,10.75; 98 -3.75,10.75; 99 -4.25,10.75; 100 -4.75,10.75; 101 -5.25,10.75; 102 -5.75,10.75; 103 -6.25,10.75; 104 -6.75,10.75; 105 -7.25,10.75; 106 -7.75,10.75; 107 -8.25,10.75; 108 -8.75,10.75 | smd 1.5 x 0.27: 37 10.75,-8.75; 38 10.75,-8.25; 39 10.75,-7.75; 40 10.75,-7.25; 41 10.75,-6.75; 42 10.75,-6.25; 43 10.75,-5.75; 44 10.75,-5.25; 45 10.75,-4.75; 46 10.75,-4.25; 47 10.75,-3.75; 48 10.75,-3.25; 49 10.75,-2.75; 50 10.75,-2.25; 51 10.75,-1.75; 52 10.75,-1.25; 53 10.75,-0.75; 54 10.75,-0.25; 55 10.75,0.25; 56 10.75,0.75; 57 10.75,1.25; 58 10.75,1.75; 59 10.75,2.25; 60 10.75,2.75; 61 10.75,3.25; 62 10.75,3.75; 63 10.75,4.25; 64 10.75,4.75; 65 10.75,5.25; 66 10.75,5.75; 67 10.75,6.25; 68 10.75,6.75; 69 10.75,7.25; 70 10.75,7.75; 71 10.75,8.25; 72 10.75,8.75; 109 -10.75,8.75; 110 -10.75,8.25; 111 -10.75,7.75; 112 -10.75,7.25; 113 -10.75,6.75; 114 -10.75,6.25; 115 -10.75,5.75; 116 -10.75,5.25; 117 -10.75,4.75; 118 -10.75,4.25; 119 -10.75,3.75; 120 -10.75,3.25; 121 -10.75,2.75; 122 -10.75,2.25; 123 -10.75,1.75; 124 -10.75,1.25; 125 -10.75,0.75; 126 -10.75,0.25; 127 -10.75,-0.25; 128 -10.75,-0.75; 129 -10.75,-1.25; 130 -10.75,-1.75; 131 -10.75,-2.25; 132 -10.75,-2.75; 133 -10.75,-3.25; 134 -10.75,-3.75; 135 -10.75,-4.25; 136 -10.75,-4.75; 137 -10.75,-5.25; 138 -10.75,-5.75; 139 -10.75,-6.25; 140 -10.75,-6.75; 141 -10.75,-7.25; 142 -10.75,-7.75; 143 -10.75,-8.25; 144 -10.75,-8.75
TSSOP20 = smd 0.3 x 0.75: 1 -2.925,-3; 2 -2.275,-3; 3 -1.625,-3; 4 -0.975,-3; 5 -0.325,-3; 6 0.325,-3; 7 0.975,-3; 8 1.625,-3; 9 2.275,-3; 10 2.925,-3; 11 2.925,3; 12 2.275,3; 13 1.625,3; 14 0.975,3; 15 0.325,3; 16 -0.325,3; 17 -0.975,3; 18 -1.625,3; 19 -2.275,3; 20 -2.925,3
TSOP-2_54 = smd 1.51 x 0.458: P$1 -5.7,10.4; P$2 -5.7,9.6; P$3 -5.7,8.8; P$4 -5.7,8; P$5 -5.7,7.2; P$6 -5.7,6.4; P$7 -5.7,5.6; P$8 -5.7,4.8; P$9 -5.7,4; P$10 -5.7,3.2; P$11 -5.7,2.4; P$12 -5.7,1.6; P$13 -5.7,0.8; P$14 -5.7,0; P$15 -5.7,-0.8; P$16 -5.7,-1.6; P$17 -5.7,-2.4; P$18 -5.7,-3.2; P$19 -5.7,-4; P$20 -5.7,-4.8; P$21 -5.7,-5.6; P$22 -5.7,-6.4; P$23 -5.7,-7.2; P$24 -5.7,-8; P$25 -5.7,-8.8; P$26 -5.7,-9.6; P$27 -5.7,-10.4; P$28 5.7,-10.4; P$29 5.7,-9.6; P$30 5.7,-8.8; P$31 5.7,-8; P$32 5.7,-7.2; P$33 5.7,-6.4; P$34 5.7,-5.6; P$35 5.7,-4.8; P$36 5.7,-4; P$37 5.7,-3.2; P$38 5.7,-2.4; P$39 5.7,-1.6; P$40 5.7,-0.8; P$41 5.7,0; P$42 5.7,0.8; P$43 5.7,1.6; P$44 5.7,2.4; P$45 5.7,3.2; P$46 5.7,4; P$47 5.7,4.8; P$48 5.7,5.6; P$49 5.7,6.4; P$50 5.7,7.2; P$51 5.7,8; P$52 5.7,8.8; P$53 5.7,9.6; P$54 5.7,10.4
SOT223 = smd 1.5 x 2: 1 -2.3,-3.15; 2 0,-3.15; 3 2.3,-3.15 | smd 3.8 x 2: 4 0,3.15
PLCC-32-SMT-TT = smd 0.71 x 1.78: 1 0,6.785; 2 -1.27,6.785; 3 -2.54,6.785; 4 -3.81,6.785; 14 -3.81,-6.785; 15 -2.54,-6.785; 16 -1.27,-6.785; 17 0,-6.785; 18 1.27,-6.785; 19 2.54,-6.785; 20 3.81,-6.785; 30 3.81,6.785; 31 2.54,6.785; 32 1.27,6.785 | smd 1.78 x 0.71: 5 -5.515,5.08; 6 -5.515,3.81; 7 -5.515,2.54; 8 -5.515,1.27; 9 -5.515,0; 10 -5.515,-1.27; 11 -5.515,-2.54; 12 -5.515,-3.81; 13 -5.515,-5.08; 21 5.515,-5.08; 22 5.515,-3.81; 23 5.515,-2.54; 24 5.515,-1.27; 25 5.515,0; 26 5.515,1.27; 27 5.515,2.54; 28 5.515,3.81; 29 5.515,5.08
7X5 = smd 1.8 x 2: P$1 -2.54,-2.1; P$2 2.54,-2.1; P$3 2.54,2.1; P$4 -2.54,2.1
R0603 = smd 1 x 1.1: 1 -0.85,0; 2 0.85,0
CAY16 = smd 0.5 x 0.65: 1 -1.2,-0.675; 2 -0.4,-0.675; 3 0.4,-0.675; 4 1.2,-0.675; 5 1.2,0.675; 6 0.4,0.675; 7 -0.4,0.675; 8 -1.2,0.675
ML40 = drill 0.914 octagon: 1 -24.13,-1.27; 2 -24.13,1.27; 3 -21.59,-1.27; 4 -21.59,1.27; 5 -19.05,-1.27; 6 -19.05,1.27; 7 -16.51,-1.27; 8 -16.51,1.27; 9 -13.97,-1.27; 10 -13.97,1.27; 11 -11.43,-1.27; 12 -11.43,1.27; 13 -8.89,-1.27; 14 -8.89,1.27; 15 -6.35,-1.27; 16 -6.35,1.27; 17 -3.81,-1.27; 18 -3.81,1.27; 19 -1.27,-1.27; 20 -1.27,1.27; 21 1.27,-1.27; 22 1.27,1.27; 23 3.81,-1.27; 24 3.81,1.27; 25 6.35,-1.27; 26 6.35,1.27; 27 8.89,-1.27; 28 8.89,1.27; 29 11.43,-1.27; 30 11.43,1.27; 31 13.97,-1.27; 32 13.97,1.27; 33 16.51,-1.27; 34 16.51,1.27; 35 19.05,-1.27; 36 19.05,1.27; 37 21.59,-1.27; 38 21.59,1.27; 39 24.13,-1.27; 40 24.13,1.27
ML10L = drill 0.914 octagon: 1 -5.08,-1.27; 2 -5.08,1.27; 3 -2.54,-1.27; 4 -2.54,1.27; 5 0,-1.27; 6 0,1.27; 7 2.54,-1.27; 8 2.54,1.27; 9 5.08,-1.27; 10 5.08,1.27

### Placement (x,y rotation side)
ACT  78.11,27.94 0 top
AUTOBOOT_OFF  24.13,87.63 270 top
C1  7.62,38.73 270 top
C2  60.33,60.33 270 top
C3  45.62,16.69 90 top
C4  60.96,16.61 270 top
C7  48.9,29.84 90 top
C8  48.9,2.54 270 top
C9  33.02,34.93 270 top
C10  55.88,34.93 90 top
C11  55.24,58.42 270 top
C12  33.02,59.05 90 top
C13  23.5,37.47 90 top
C14  67.94,83.82 180 top
C15  67.31,52.71 180 top
C16  31.75,81.91 90 top
C17  67.94,74.3 180 top
C19  67.31,9.53 90 top
C20  12.7,36.2 90 top
C21  15.24,20.95 270 top
C22  16.51,33.66 0 top
C23  69.22,59.05 90 top
F1  65.41,60.33 90 top
IC1  13.97,40.01 90 top
IC2  44.45,46.36 90 top
IC3  66.67,79.38 270 top
IC4  66.67,69.21 270 top
IC5  66.67,48.26 270 top
IC6  53.34,15.88 0 top
IC7  15.24,28.57 180 top
IC8  43.18,79.38 90 top
IC9  16.51,42.55 90 top
IC10  71.12,9.53 90 top
MEM_OFF  18.41,87.63 90 top
POWER  4.45,87.63 90 top
R1  66.04,6.99 180 top
R2  61.77,52.83 180 top
R3  69.85,55.25 270 top
R4  74.93,20.95 270 top
R5  29.21,87.63 180 top
R6  13.34,87.63 0 top
R7  78.11,22.86 90 top
R8  17.7,39.83 180 top
RN1  32.38,27.3 180 top
RN2  35.56,24.76 180 top
RN3  38.73,27.3 180 top
RN4  41.91,24.76 180 top
RN5  45.09,27.3 180 top
RN6  61.59,32.39 0 top
RN7  64.77,29.84 0 top
RN8  67.94,27.3 0 top
RN9  71.12,29.84 0 top
RN10  74.3,27.3 0 top
RN11  60.93,83.03 180 top
SV1  75.56,60.33 270 top
SV2  59.69,86.36 0 top

### Tracks (layer width: path | path; a pad name or v marks a point on that pad's centre or on a via)
!BERR
  Top 0.254: IC2.75 32.26,54.11 28.57,57.79 IC9.22
  Top 0.813: IC1.22 IC9.22
!BG
  Top 0.813: IC1.11 IC9.11
!BGACK
  Top 0.254: IC9.12 26.9,33.43 26.9,38.08 27.28,38.46 28.96,38.46 30.11,39.61 IC2.104
  Bottom 0.813: IC1.12 IC9.12
!BR
  Bottom 0.813: IC1.13 IC9.13
!CAS
  Top 0.254: RN3.3 38.34,28.3 41.2,31.17 IC2.120
!DTACK
  Top 0.254: IC2.103 29.61,40.11 28.42,38.91 27.13,38.91 26.44,38.23 26.44,29.46 25.55,28.57 24.77,28.57 24.13,27.94 24.13,26.04 IC1.10
  Top 0.813: IC1.10 IC9.10
!HALT
  Top 0.813: IC1.17 IC9.17
!IDE_ACT
  Top 0.254: SV1.39 78.11,32.39 ACT.2
!IDE_R
  Top 0.254: IC5.16 70.81,48.59 73.03,50.8 73.03,52.71 SV1.25
!IDE_W
  Top 0.254: IC5.17 70.83,49.23 72.39,50.8 72.39,54.61 SV1.23
!LDS
  Top 0.254: IC2.101 29.13,41.11 28.73,41.5 23.72,41.5 21.59,39.37 21.59,23.49 IC1.8
  Top 0.813: IC1.8 IC9.8
!MEM_CS
  Top 0.254: RN2.1 36.76,28.5 39.05,30.8 39.37,31.11 40.2,31.94 IC2.118
!MEM_WE
  Top 0.254: RN3.2 39.13,28.39 41.7,30.96 IC2.121
!RAS
  Top 0.254: RN3.4 37.53,28.37 40.7,31.53 IC2.119
!RESET  (via drill 0.3)
  Top 0.254: v59.69,33.66 59.05,33.02 53.98,33.02 52.7,34.3 IC2.143 52.7,40.01 v45.09,47.62 | IC5.2 64.4,50.54 v64.77,50.16
  Top 0.813: IC1.18 IC9.18
  Bottom 0.254: v59.69,33.66 59.69,46.99 62.87,50.16 v64.77,50.16 | IC9.18 v45.09,47.62
!UDS
  Top 0.254: IC2.105 30.85,39.11 29.21,37.47 29.21,20.95 IC9.7
  Top 0.813: IC1.7 IC9.7
+3V3  (via drill 0.3, 0.6)
  Top 0.254: IC6.P$49 59.02,22.25 v57.76,22.25 | IC6.P$1 47.62,26.27 | v48.92,15.88 IC6.P$14 47.58,15.81 C3.1 | v48.92,19.89 47.65,19.89 IC6.P$9 | v57.76,17.47 IC6.P$43 59.05,17.49 C4.1 | v57.76,17.47 | IC6.P$3 48.91,24.67 v48.92,24.69 | IC2.141 v51.7,36.9 v51.69,36.91 | IC2.8 53.93,41.11 v53.92,41.1 | IC2.127 v44.7,36.9 v44.7,36.91 | v35.08,49.61 IC2.84 | IC2.1 56.38,37.61 56.52,37.47 56.52,36.2 56.12,35.8 C10.2 | IC2.55 v44.2,55.83 | IC2.42 50.7,55.93 v50.8,55.83 | IC2.37 53.2,58.28 54.22,59.3 C11.1 v55.24,60.33 | IC2.109 35.7,34.79 34.96,34.05 C9.2 v33.02,33.02 | v34.29,57.79 33.41,57.79 C12.1 33.02,55.79 IC2.73
  Top 0.305: 47.62,26.27 47.62,27.94 48.66,28.97 C7.1 v48.9,27.94 | C10.2 53.94,35.8 v53.92,35.81 | v48.9,4.45 C8.1 47.64,4.67 IC6.P$27
  Top 0.406: R1.2 v64.14,6.99
  Top 0.813: 15.51,33.78 C22.1 15.21,33.23 15.24,33.23 IC7.2 v15.24,28.57
  other vias: 12.7,26.04 12.7,24.76 12.7,23.49 13.97,23.49 15.24,23.49 16.51,23.49 17.78,23.49 17.78,24.76 17.78,26.04 17.78,27.3 16.51,27.3 15.24,27.3 13.97,27.3 12.7,27.3
  pour Route15: 0,27.94 13.97,27.94 13.97,37.47 21.59,37.47 21.59,33.02 30.48,33.02 30.48,61.59 60.96,61.59 60.96,19.05 82.55,19.05 82.55,-0.64 0,-0.64
  pour Top (isolate 0.254): 11.43,29.84 19.05,29.84 19.05,20.95 11.43,20.95
+5V  (via drill 0.3, 0.6, 0.7)
  Top 0.254: IC5.20 68.83,51.19 68.19,51.83 C15.1 v69.22,52.71 | IC5.1 v62.72,51.19 v62.71,51.18 | R3.1 68.64,56.09 v68.63,56.08 | R7.1 v78.11,20.32 | R8.2 v15.57,39.83 | RN11.8 RN11.7 RN11.6 62.67,82.36 63.5,83.18 v64.14,83.18
  Top 0.305: IC4.20 68.82,72.99 C17.1 v69.85,74.3 | v69.85,83.82 C14.1 69.67,82.96 IC3.20
  Top 0.406: IC8.32 32.15,80.64 C16.1 30.72,81.04 v30.48,81.28
  Top 0.61: C2.1 v60.33,62.87
  Top 0.813: C1.1 7.62,40.01 IC9.49 | IC1.14 24.13,34.93 23.5,35.56 C13.1 | 12.93,34.97 C20.1 | C20.1 10.43,35.2 v10.16,34.93 | IC7.3 12.7,31.72 C20.1 | v11.43,32.39 v11.43,33.66 v10.16,33.66 v10.16,34.93 | v10.16,34.93 v10.16,32.39 v11.43,32.39 | v11.43,32.39 11.43,34.93 | F1.2 v67.96,63.12 v67.97,63.12 | v62.79,63.12 65.15,63.12 65.41,62.87
  pour Route15: 0,28.57 13.34,28.57 13.34,38.1 22.23,38.1 22.23,33.66 29.84,33.66 29.84,62.23 61.59,62.23 61.59,19.68 82.55,19.68 82.55,89.53 0,89.53
A1  (via drill 0.3)
  Top 0.254: v40.01,66.04 40.01,65.41 43.2,62.21 IC2.57 | IC8.12 46.99,72.39 45.72,71.12 v40.01,71.12
  Top 0.813: IC1.29 IC9.29
  Bottom 0.254: IC9.29 36.83,75.56 40.01,72.39 v40.01,71.12 v40.01,66.04
A2  (via drill 0.3)
  Top 0.254: v41.27,66.04 41.27,65.41 44.7,61.98 IC2.54 | IC8.11 45.72,76.83 45.09,77.47 v41.27,77.47
  Top 0.813: IC1.30 IC9.30
  Bottom 0.254: IC9.30 40.64,78.1 v41.27,77.47 v41.27,66.04
A3  (via drill 0.3)
  Top 0.254: IC2.52 45.7,62.25 42.55,65.41 v42.55,66.04 | IC8.10 44.45,73.02 43.81,72.39 v42.55,72.39
  Top 0.813: IC1.31 IC9.31
  Bottom 0.254: IC9.31 41.91,80.64 42.55,80.01 v42.55,72.39 42.55,71.12 v42.55,66.04
A4  (via drill 0.3)
  Top 0.254: v43.81,66.04 46.7,63.16 IC2.50 | IC8.9 43.18,74.93 v43.81,75.56
  Top 0.813: IC1.32 IC9.32
  Bottom 0.254: IC9.32 42.55,83.18 43.81,81.91 43.81,78.74 v43.81,75.56 v43.81,66.04
A5  (via drill 0.3)
  Top 0.254: v44.45,66.67 47.2,63.93 IC2.49 | IC8.8 41.91,75.01 43.1,76.2 v44.45,76.2
  Top 0.813: IC1.33 IC9.33
  Bottom 0.254: IC9.33 6.35,84.45 42.55,84.45 44.45,82.55 v44.45,76.2 v44.45,66.67
A6  (via drill 0.3)
  Top 0.254: v43.18,66.67 43.18,65.41 46.2,62.39 IC2.51 | IC8.7 40.64,74.93 42.55,76.83 v43.18,76.83
  Top 0.813: IC1.34 IC9.34
  Bottom 0.254: IC9.34 6.35,81.91 42.55,81.91 43.18,81.28 v43.18,76.83 | v43.18,76.83 v43.18,66.67 | v43.18,76.83 43.18,78.74
A7  (via drill 0.3)
  Top 0.254: v41.91,66.67 41.91,65.41 45.2,62.12 IC2.53 | IC8.6 v39.37,79.38
  Top 0.813: IC1.35 IC9.35
  Bottom 0.254: IC9.35 6.35,79.38 v39.37,79.38 40.01,79.38 41.27,79.38 41.91,78.74 v41.91,66.67
A8  (via drill 0.3)
  Top 0.254: v40.64,66.67 40.64,65.41 43.7,62.34 IC2.56 | IC8.5 v38.1,75.56
  Top 0.813: IC1.36 IC9.36
  Bottom 0.254: IC9.36 6.35,76.83 36.83,76.83 v38.1,75.56 40.64,73.02 v40.64,66.67
A9  (via drill 0.3)
  Top 0.254: v39.37,66.67 39.37,65.41 42.7,62.08 IC2.58 | IC8.27 40.64,81.91 38.73,80.01 v38.73,72.44
  Top 0.813: IC1.37 IC9.37
  Bottom 0.254: IC9.37 6.35,74.3 36.83,74.3 38.73,72.39 v38.73,72.44 39.37,71.81 v39.37,66.67
A10  (via drill 0.3)
  Top 0.254: IC2.59 42.2,61.94 38.73,65.41 v38.73,66.04 | IC8.26 41.91,79.38 40.01,77.47 40.01,72.85 38.73,71.58 v38.73,71.12
  Top 0.813: IC1.38 IC9.38
  Bottom 0.254: IC9.38 6.35,71.75 38.1,71.75 v38.73,71.12 v38.73,66.04
A11  (via drill 0.3)
  Top 0.254: IC2.60 41.7,61.8 38.1,65.41 v38.1,66.67 38.1,68.58 40.01,70.48 45.72,70.48 47.62,72.39 47.62,74.93 46.99,75.56 46.99,78.1 45.72,79.38 IC8.23
  Top 0.813: IC1.39 IC9.39
  Bottom 0.254: IC9.39 6.35,69.21 37.47,69.21 38.1,68.58 v38.1,66.67
A12  (via drill 0.3)
  Top 0.254: IC2.61 41.2,61.67 37.47,65.41 v37.47,66.04 37.47,68.58 39.37,70.48 39.37,71.42 39.7,71.75 45.72,71.75 46.35,72.39 46.35,78.1 43.18,81.28 IC8.25
  Top 0.813: IC1.40 IC9.40
  Bottom 0.254: IC9.40 6.35,66.67 36.83,66.67 v37.47,66.04
A13  (via drill 0.3)
  Top 0.254: IC2.64 39.7,61.9 v37.47,64.13 36.4,65.2 IC8.4
  Top 0.813: IC1.41 IC9.41
  Bottom 0.254: IC9.41 6.35,64.13 v37.47,64.13
A14  (via drill 0.3)
  Top 0.254: IC2.66 38.7,61 v38.1,61.59 38.1,62.87 37.47,63.5 36.83,63.5 34.92,65.41 34.92,75.87 35.26,76.2 37.47,76.2 38.1,76.83 38.1,80.01 39.37,81.28 IC8.28
  Top 0.813: IC1.42 IC9.42
  Bottom 0.254: IC9.42 6.35,61.59 v38.1,61.59
A15  (via drill 0.3)
  Top 0.254: IC8.29 30.91,84.89 29.21,83.18 29.21,80.01 31.75,77.47 v31.75,58.42 31.75,55.25 32.38,54.61 IC2.74
  Top 0.813: IC1.43 IC9.43
  Bottom 0.254: IC9.43 6.35,59.05 31.11,59.05 v31.75,58.42
A16  (via drill 0.3)
  Top 0.254: IC2.76 31.48,53.61 v31.11,53.98
  Top 0.813: IC1.44 IC9.44
  Bottom 0.254: v31.11,53.98 6.35,53.98 IC9.44
A17
  Top 0.254: IC2.79 30.52,52.11 29.59,51.18 22.61,51.18 21.08,52.71 IC9.45
  Top 0.813: IC1.45 IC9.45
A18  (via drill 0.3)
  Top 0.254: IC2.83 29.79,50.11 v29.53,49.85
  Top 0.813: IC1.46 IC9.46
  Bottom 0.254: IC9.46 6.35,48.9 28.57,48.9 v29.53,49.85
A19  (via drill 0.3)
  Top 0.254: IC2.91 29.46,46.11 v29.21,46.36
  Top 0.813: IC1.47 IC9.47
  Bottom 0.254: v29.21,46.36 6.35,46.36 IC9.47
A20  (via drill 0.3)
  Top 0.254: IC2.95 30.85,44.11 30.81,44.15 v30,44.15
  Top 0.813: IC1.48 IC9.48
  Bottom 0.254: IC9.48 6.12,44.04 29.67,44.04 29.77,44.15 v30,44.15
A21  (via drill 0.3)
  Top 0.254: IC2.96 30.55,43.61 v30.5,43.56
  Top 0.813: IC1.50 IC9.50
  Bottom 0.254: IC9.50 8.64,43.56 v30.5,43.56
A22  (via drill 0.3)
  Top 0.254: v30.48,42.24 31.34,43.11 IC2.97
  Top 0.813: IC1.51 IC9.51
  Bottom 0.254: IC9.51 9.17,41.55 29.79,41.55 v30.48,42.24
A23  (via drill 0.3)
  Top 0.254: v31.75,41.91 32.45,42.61 IC2.98
  Top 0.813: IC1.52 IC9.52
  Bottom 0.254: IC9.52 11.25,41.1 30.94,41.1 v31.75,41.91
A_MEM0
  Top 0.254: IC2.113 37.7,32.62 33.59,28.5 RN1.1
A_MEM1
  Top 0.254: IC2.112 37.2,32.76 36.83,32.39 32.78,28.34 RN1.2
A_MEM2
  Top 0.254: IC2.111 36.7,33.52 31.98,28.81 RN1.3
A_MEM3
  Top 0.254: IC2.110 36.2,34.3 31.18,29.28 RN1.4
A_MEM4
  Top 0.254: IC2.21 60.34,47.61 73.89,34.05 RN10.7
A_MEM5
  Top 0.254: IC2.20 59.58,47.11 73.09,33.59 RN10.8
A_MEM6
  Top 0.254: IC2.19 58.96,46.61 72.32,33.24 RN9.5
A_MEM7
  Top 0.254: IC2.17 59.17,45.61 71.52,33.26 RN9.6
A_MEM8
  Top 0.254: IC2.16 59.03,45.11 70.72,33.42 RN9.7
A_MEM9
  Top 0.254: IC2.15 58.9,44.61 69.92,33.59 RN9.8
A_MEM10
  Top 0.254: RN2.4 34.36,28.01 37.15,30.8 37.47,31.11 38.7,32.35 IC2.115
A_MEM11
  Top 0.254: IC2.14 58.69,44.11 69.14,33.65 RN8.5
AS_CPU  (via drill 0.3)
  Top 0.254: IC2.106 31.62,38.61 v29.86,36.84 29.84,36.83 29.84,19.05 IC9.6 | R8.1 v19.68,39.83
  Bottom 0.254: v19.68,39.83 19.86,39.83 23.5,36.2 29.21,36.2 v29.86,36.84
AS_SOCKET
  Top 0.254: IC1.6 26.67,15.88 29.21,15.88 30.48,17.14 30.48,36.2 32.39,38.11 IC2.107
AUTO_BOOT_OFF
  Top 0.254: IC2.78 29.75,52.61 28.8,51.66 23.9,51.66 23.5,52.07 23.5,84.45 25.4,86.36 AUTOBOOT_OFF.2 R5.2
BA0
  Top 0.254: RN2.2 35.96,28.34 39.7,32.08 IC2.117
BA1
  Top 0.254: RN2.3 35.16,28.17 39.2,32.22 IC2.116
C_IDE_A0
  Top 0.254: IC5.7 63.2,47.29 61.38,49.11 IC2.24
C_IDE_A1
  Top 0.254: IC5.5 63.17,48.59 61.66,50.11 IC2.26
C_IDE_A2
  Top 0.254: IC5.6 63.19,47.94 61.52,49.61 IC2.25
C_IDE_CS0
  Top 0.254: IC5.9 63.23,45.98 61.12,48.11 IC2.22
C_IDE_CS1
  Top 0.254: IC2.23 61.25,48.61 63.22,46.64 IC5.8
C_IDE_R  (via drill 0.3)
  Top 0.254: v64.95,82.32 63.65,82.32 IC3.1 | IC2.27 61.79,50.61 63.16,49.23 IC5.4 64.96,49.23 v64.97,49.25 | IC4.1 64.93,72.14 v64.95,72.16
  Bottom 0.254: v64.95,82.32 v64.95,72.16 66.04,71.07 66.04,50.16 65.13,49.25 v64.97,49.25
C_IDE_W
  Top 0.254: IC5.3 63.15,49.89 61.92,51.11 IC2.28
CKE
  Top 0.254: IC2.13 58.57,43.61 68.34,33.84 RN8.6
CLK  (via drill 0.3)
  Top 0.254: IC2.32 54.03,53.11
  Top 0.305: 54.03,53.11 46.13,53.11 v45.72,52.71
  Bottom 0.305: IC9.15 42.55,40.01 45.72,43.18 v45.72,52.71
  Bottom 0.813: IC1.15 IC9.15
CLK_EXT
  Top 0.254: 56.52,52.07 56.48,52.11 IC2.30
  Top 0.406: R4.1 74.93,24.76 76.2,26.04 76.2,32.74 66.04,42.9 66.04,50.11 64.26,51.89 57.33,51.89 57.15,52.07 56.52,52.07
CLK_MEM
  Top 0.254: IC2.12 58.37,43.1 67.55,33.93 RN8.7
D0  (via drill 0.3)
  Top 0.254: IC2.134 48.2,33.08 52.07,29.21 52.07,27.94 v52.7,27.3 | IC8.13 53.14,73.86 v53.34,73.66 | IC3.3 59.34,81 59.05,81.28 v53.34,81.28
  Top 0.813: IC1.5 IC9.5
  Bottom 0.254: IC9.5 52.07,14.61 52.7,15.24 v52.7,27.3 52.7,32.39 52.07,33.02 52.07,36.2 52.7,36.83 52.7,37.47 52.07,38.1 52.07,62.87 52.7,63.5 52.7,69.21 53.34,69.85 v53.34,73.66 v53.34,81.28
D1  (via drill 0.3)
  Top 0.254: IC8.14 v53.98,75.56 | IC3.5 57.46,79.7 57.15,80.01 v53.98,80.01 | IC2.136 49.2,33.35 v53.98,28.57
  Top 0.813: IC1.4 IC9.4
  Bottom 0.254: IC9.4 52.7,12.06 53.98,13.34 v53.98,28.57 53.98,33.02 53.34,33.66 53.34,36.2 53.98,36.83 53.98,38.73 53.34,39.37 53.34,61.59 53.98,62.23 v53.98,75.56 v53.98,80.01
D2  (via drill 0.3)
  Top 0.254: IC8.15 v55.24,76.83 | IC2.39 52.2,58.55 v54.61,60.96 | v55.24,78.03 55.42,78.21 57.99,78.21 58.18,78.4 IC3.7
  Top 0.813: IC1.3 IC9.3
  Bottom 0.254: IC9.3 53.34,9.53 55.24,11.43 55.24,54.61 54.61,55.25 v54.61,60.96 55.24,61.59 v55.24,76.83 v55.24,78.03
D3  (via drill 0.3)
  Top 0.254: v56.52,79.38 IC8.17 | IC3.9 56.53,77.1 v56.52,77.11 | IC2.138 50.2,33.62 53.98,29.84 v56.52,29.84
  Top 0.813: IC1.2 IC9.2
  Bottom 0.254: IC9.2 55.24,6.99 56.52,8.26 v56.52,29.84 v56.52,77.11 v56.52,79.38
D4  (via drill 0.3)
  Top 0.254: v58.42,80.64 IC8.18 | IC4.3 v58.42,70.84 | IC2.140 51.2,33.89 53.98,31.11 v58.42,31.11
  Top 0.813: IC1.1 IC9.1
  Bottom 0.254: IC9.1 47.62,4.45 48.9,5.71 56.52,5.71 58.42,7.62 v58.42,31.11 v58.42,70.84 v58.42,80.64
D5  (via drill 0.3)
  Top 0.254: v57.78,81.91 IC8.19 | IC4.5 v59.06,69.54 v59.05,69.55 | IC2.142 52.2,33.52 53.98,31.75 v59.05,31.75
  Top 0.813: IC1.64 IC9.64
  Bottom 0.254: v57.78,81.91 58.42,81.91 59.05,81.28 v59.05,69.55 v59.05,31.75 59.05,4.45 57.78,3.17 24.13,3.17 22.86,4.45 IC9.64
D6  (via drill 0.3)
  Top 0.254: v56.52,83.18 IC8.20 | IC4.7 57.17,68.24 v57.15,68.22 | IC2.139 50.7,33.76 53.98,30.48 v57.15,30.48
  Top 0.813: IC1.63 IC9.63
  Bottom 0.254: IC9.63 23.5,6.99 24.77,5.71 47.62,5.71 48.26,6.35 55.88,6.35 57.15,7.62 v57.15,30.48 v57.15,68.22 57.15,82.55 v56.52,83.18
D7  (via drill 0.3)
  Top 0.254: v55.88,82.55 48.9,82.55 48.26,83.18 IC8.21 | IC4.9 55.89,66.94 v55.88,66.93 | IC2.137 49.7,33.48 53.98,29.21 v55.88,29.21
  Top 0.813: IC1.62 IC9.62
  Bottom 0.254: IC9.62 22.86,9.53 24.13,8.26 54.61,8.26 55.88,9.53 v55.88,29.21 v55.88,66.93 v55.88,82.55
D8  (via drill 0.3)
  Top 0.254: IC4.8 v54.61,67.59 | IC2.135 48.7,33.22 52.7,29.21 52.7,28.57 53.34,27.94 v54.61,27.94
  Top 0.813: IC1.61 IC9.61
  Bottom 0.254: IC9.61 22.86,12.06 24.13,10.79 52.7,10.79 54.61,12.7 v54.61,27.94 54.61,53.98 53.98,54.61 53.98,61.59 54.61,62.23 v54.61,67.59
D9  (via drill 0.3)
  Top 0.254: IC4.6 v53.34,68.89 v53.34,68.88 | IC2.40 51.7,61.23 v52.7,62.23
  Top 0.813: IC1.60 IC9.60
  Bottom 0.254: IC9.60 22.86,14.61 24.13,13.34 52.07,13.34 53.34,14.61 53.34,32.39 52.7,33.02 52.7,36.2 53.34,36.83 53.34,38.1 52.7,38.73 v52.7,62.23 53.34,62.87 v53.34,68.88
D10  (via drill 0.3)
  Top 0.254: IC2.41 51.2,62.63 v51.44,62.87 | IC4.4 v52.08,70.19 v52.07,70.18
  Top 0.813: IC1.59 IC9.59
  Bottom 0.254: v52.07,70.18 52.07,63.5 v51.44,62.87 51.44,38.73 50.8,38.1 50.8,17.14 50.16,16.51 46.99,16.51 46.35,15.88 24.13,15.88 23.5,16.51 5.71,16.51 IC9.59
D11  (via drill 0.3)
  Top 0.254: IC4.2 51.48,71.49 v51.46,71.48 | IC2.43 50.2,62.83 v50.16,62.87
  Top 0.813: IC1.58 IC9.58
  Bottom 0.254: v51.46,71.48 51.44,71.45 51.44,64.13 v50.16,62.87 50.16,31.11 49.53,30.48 49.53,29.21 50.16,28.57 50.16,19.68 48.9,18.41 24.13,18.41 22.86,17.14 7.62,17.14 IC9.58
D12  (via drill 0.3)
  Top 0.254: IC2.44 49.7,62.06 v49.53,62.23 | IC3.8 56.13,77.75 55.83,77.44 v52.7,77.44
  Top 0.813: IC1.57 IC9.57
  Bottom 0.254: v52.7,77.44 52.7,74.3 50.8,72.39 50.8,64.77 49.53,63.5 v49.53,62.23 49.53,31.75 48.9,31.11 48.9,29.21 49.53,28.57 49.53,21.59 48.9,20.95 24.13,20.95 22.86,19.68 7.62,19.68 IC9.57
D13  (via drill 0.3)
  Top 0.254: IC2.45 49.2,61.29 v48.9,61.59 | IC3.6 57.28,79.05 56.97,78.74 52.7,78.74 v52.07,78.1
  Top 0.813: IC1.56 IC9.56
  Bottom 0.254: IC9.56 9.53,20.32 21.59,20.32 24.77,23.49 47.62,23.49 48.26,24.13 48.26,31.75 48.9,32.39 v48.9,61.59 48.9,64.13 50.16,65.41 50.16,73.02 52.07,74.93 v52.07,78.1
D14  (via drill 0.3)
  Top 0.254: IC2.46 48.7,60.52 v48.26,60.96 | IC3.4 60.39,80.35 v60.38,80.37
  Top 0.813: IC1.55 IC9.55
  Bottom 0.254: IC9.55 11.43,20.95 19.05,20.95 24.13,26.04 46.35,26.04 47.62,27.3 47.62,32.39 48.26,33.02 48.26,54.61 47.62,55.25 47.62,58.42 48.44,59.23 48.44,60.2 48.26,60.38 v48.26,60.96 48.26,64.77 49.53,66.04 49.53,73.66 51.44,75.56 51.44,80.64 54.61,83.82 58.42,83.82 59.69,82.55 59.69,80.64 59.97,80.37 v60.38,80.37
D15  (via drill 0.3)
  Top 0.254: IC2.48 47.7,59.61 v47.85,59.77 | v53.34,83.82 57.15,83.82 59.32,81.65 IC3.2
  Top 0.813: IC1.54 IC9.54
  Bottom 0.254: IC9.54 12.7,22.22 18.41,22.22 24.77,28.57 46.35,28.57 46.99,29.21 46.99,33.02 47.62,33.66 47.62,53.98 46.99,54.61 46.99,58.9 v47.85,59.77 47.85,60.1 47.62,60.33 47.62,65.41 48.9,66.67 48.9,74.3 50.8,76.2 50.8,81.28 v53.34,83.82
DQ0
  Top 0.254: RN5.1 46.28,29.14 47.7,30.55 IC2.133
DQ1
  Top 0.254: RN5.2 45.48,29.18 47.2,30.89 IC2.132
DQ2
  Top 0.254: RN5.3 44.69,29.14 46.71,31.17 46.71,35.59 IC2.131
DQ3
  Top 0.254: RN5.4 43.88,29.13 46.2,31.44 IC2.130
DQ4
  Top 0.254: RN4.1 43.11,29.14 45.7,31.73 IC2.129
DQ5
  Top 0.254: RN4.2 42.31,28.97 45.2,31.86 IC2.128
DQ6
  Top 0.254: RN4.3 41.51,28.81 44.2,31.5 IC2.126
DQ7
  Top 0.254: RN4.4 40.71,28.64 43.7,31.64 IC2.125
DQ8
  Top 0.254: IC2.10 57.84,42.11 65.97,33.98 RN7.5
DQ9
  Top 0.254: IC2.9 57.43,41.61 63.17,35.87 63.27,35.77 65.17,33.87 RN7.6 | IC2.9
DQ10
  Top 0.254: IC2.7 57.62,40.61 64.37,33.85 RN7.7
DQ11
  Top 0.254: IC2.6 57.4,40.11 63.57,33.94 RN7.8
DQ12
  Top 0.254: IC2.5 57.17,39.61 62.79,33.98 RN6.5
DQ13
  Top 0.254: IC2.4 56.9,39.12 61.99,34.02 RN6.6
DQ14
  Top 0.254: IC2.3 56.67,38.61 61.19,34.09 RN6.7
DQ15
  Top 0.254: RN6.8 60.4,34.22 56.51,38.11 IC2.2
E
  Bottom 0.813: IC1.20 IC9.20
FC0
  Top 0.813: IC1.28 IC9.28
FC1
  Top 0.813: IC1.27 IC9.27
FC2
  Top 0.813: IC1.26 IC9.26
GND  (via drill 0.3, 0.6, 0.7)
  Top 0.254: IC6.P$52 57.77,24.67 v57.76,24.69 | v57.76,19.86 57.75,19.88 IC6.P$46 | v48.92,17.47 IC6.P$12 | IC6.P$12 | IC6.P$6 48.89,22.27 v48.92,22.3 | v57.76,15.88 IC6.P$41 60.82,15.88 C4.2 | v38.2,36.91 IC2.114 | IC2.99 v35.07,42.11 v35.08,42.11 | IC2.90 35.06,46.61 v35.08,46.58 34.56,47.11 IC2.89 | IC2.18 53.95,46.11 v53.92,46.13 | v53.92,51.59 53.94,51.61 IC2.29 | IC2.62 40.7,55.84 v40.69,55.83 | IC5.19 v68.67,50.54 v68.66,50.55 | v64.92,45.34 IC5.10 | C15.2 v65.41,52.71 65.28,52.83 R2.1 | R5.1 v31.11,87.63 | IC2.36 55.24,55.15 v55.24,55.88 C11.2 | C9.1 33.66,36.44 v33.66,36.83 33.66,37.56 IC2.108 | IC2.47 48.2,55.84 v48.21,55.83 | IC2.123 42.7,33.81 v42.55,33.66 | IC2.72 35.7,58.28 34.05,59.93 C12.2 v33.02,60.96 | R6.1 v10.79,87.63 | C8.2 v50.18,1.66 v50.19,1.68 | C3.2 47.55,17.56 IC6.P$12 | IC8.22 v46.99,86.36
  Top 0.305: C17.2 v66.04,74.3 | IC3.10 v62.84,76.45 | IC4.10 v62.84,66.29 | IC4.19 70.55,71.49 v70.56,71.5 | IC3.19 70.5,81.65 v70.51,81.66 | C14.2 v66.04,83.82 | IC6.P$54 57.77,26.27 v57.76,26.29 | IC2.144 53.2,34.79 v53.92,34.06 C10.1 | IC6.P$28 v57.72,5.48 v57.71,5.49
  Top 0.406: IC10.P$2 71.56,10.4 C19.2 67.31,11.2 v67.13,11.38 | C16.2 30.72,82.79 v30.48,82.55 | C7.2 49.29,30.72 v50.16,29.84
  Top 0.61: IC8.16 49.23,78.1 48.36,78.97 v48.36,79.93 | C2.2 v60.33,57.79
  Top 0.813: 17.5,33.54 C22.2 17.39,31.72 IC7.1 19.05,31.72 v19.05,32.39 | C1.2 7.62,34.93 IC9.53 | C20.2 v12.7,38.73 | IC1.16 24.13,40.01 23.5,39.37 C13.2 | C21.2 v15.24,18.41 | v16.51,18.41 v13.97,18.41 | C23.2 v69.22,61.59
  other vias: 19.05,36.2 19.05,34.93 19.05,33.66 20.32,36.2 20.32,34.93 20.32,33.66 20.32,32.39 47.9,67.34 47.9,68.61 47.9,69.88 79.02,88.29 79.02,87.02 77.75,88.29 79.02,1.3 79.02,2.57 77.75,1.3 0.91,1.3 0.91,2.57
  pour Route2: 0,-0.64 82.55,-0.64 82.55,88.9 82.55,89.53 0,89.53
  pour Top: 17.14,37.47 21.59,37.47 21.59,30.48 17.14,30.48
  pour Top (isolate 0.254, rank 2): 0,-0.64 82.55,-0.64 82.55,88.9 82.55,89.53 0,89.53
  pour Bottom: 0,-0.64 82.55,-0.64 82.55,88.9 82.55,89.53 0,89.53
IDE_A0
  Top 0.254: IC5.13 70.2,46.64 71.75,45.09 71.75,43.82 SV1.35
IDE_A1
  Top 0.254: IC5.15 70.17,47.94 SV1.33
IDE_A2
  Top 0.254: IC5.14 70.19,47.29 72.39,45.09 72.39,44.04 73.74,42.7 75.41,42.7 SV1.36
IDE_CS0
  Top 0.254: IC5.11 70.23,45.34 70.48,45.09 70.48,42.55 SV1.37
IDE_CS1
  Top 0.254: IC5.12 70.22,45.98 71.12,45.09 71.12,42.55 73.66,40.01 75.56,40.01 SV1.38
IDE_IRQ  (via drill 0.3)
  Top 0.254: SV1.31 73.66,46.36 73.03,46.99 v73.03,49.53 | v69.85,52.07 69.85,53.04 69.29,53.59 64.44,53.59 64.21,53.82 61.91,53.82 R2.2 60.7,52.61 IC2.31
  Bottom 0.254: v73.03,49.53 72.39,49.53 v69.85,52.07
IDE_RST
  Top 0.254: IC5.18 70.2,49.89 71.75,51.44 71.75,56.52 73.03,57.79 77.47,57.79 78.11,58.42 78.11,85.09 77.47,85.72 75.56,85.72 SV1.1
IDE_WAIT  (via drill 0.3)
  Top 0.254: v71.12,52.07 71.12,53.12 R3.2 60.11,54.4 59.32,53.61 IC2.33
  Bottom 0.254: SV1.27 71.75,51.44 v71.12,52.07
IDED0
  Top 0.254: IC4.12 70.86,66.94 73.66,64.13 SV1.17
IDED1
  Top 0.254: IC4.14 72.73,68.24 SV1.15
IDED2
  Top 0.254: IC4.16 73.97,69.54 SV1.13
IDED3
  Top 0.254: IC4.18 73.38,70.84 SV1.11
IDED4
  Top 0.254: IC3.12 71.49,77.1 SV1.9
IDED5
  Top 0.254: IC3.14 72.73,78.4 SV1.7
IDED6
  Top 0.254: IC3.16 73.97,79.7 SV1.5
IDED7
  Top 0.254: IC3.18 73.38,81 SV1.3
IDED8
  Top 0.254: IC3.17 73.36,80.35 73.66,80.64 75.56,80.64 SV1.4
IDED9
  Top 0.254: IC3.15 72.72,79.05 73.66,78.1 75.56,78.1 SV1.6
IDED10
  Top 0.254: IC3.13 71.47,77.75 73.66,75.56 75.56,75.56 SV1.8
IDED11
  Top 0.254: IC3.11 70.23,76.45 73.66,73.02 75.56,73.02 SV1.10
IDED12
  Top 0.254: IC4.17 73.36,70.19 73.66,70.48 75.56,70.48 SV1.12
IDED13
  Top 0.254: IC4.15 72.72,68.89 73.66,67.94 75.56,67.94 SV1.14
IDED14
  Top 0.254: IC4.13 71.47,67.59 73.66,65.41 75.56,65.41 SV1.16
IDED15
  Top 0.254: IC4.11 70.23,66.29 73.66,62.87 75.56,62.87 SV1.18
IPL0
  Top 0.813: IC1.25 IC9.25
IPL1
  Top 0.813: IC1.24 IC9.24
IPL2
  Top 0.813: IC1.23 IC9.23
KEY_PIN_POWER
  Top 0.813: F1.1 65.94,58.05 C23.1 71.39,58.05 73.66,60.33 75.56,60.33 SV1.20
LDQM
  Top 0.254: RN3.1 39.94,28.5 43.2,31.77 IC2.124
MEM_OFF  (via drill 0.3)
  Top 0.254: R6.2 MEM_OFF.2 22.23,82.55 v22.23,56.52 | IC2.77 30.71,53.11 29.84,53.98 29.84,55.25 v28.57,56.52
  Bottom 0.254: v28.57,56.52 v22.23,56.52
N$1
  Top 0.254: RN1.5 31.18,14.54 39.45,6.28 IC6.P$26
N$2
  Top 0.254: RN1.6 31.98,15.01 32.7,14.29 33.02,13.97 39.91,7.08 IC6.P$25
N$3
  Top 0.254: RN1.7 32.78,15.47 33.97,14.29 34.29,13.97 40.38,7.88 IC6.P$24
N$4
  Top 0.254: IC6.P$23 40.85,8.68 33.59,15.94 RN1.8
N$5
  Top 0.254: RN2.5 34.36,16.44 41.33,9.47 IC6.P$22
N$6
  Top 0.254: RN2.6 35.16,16.91 41.8,10.28 IC6.P$21
N$7
  Top 0.254: RN2.7 35.96,17.38 42.27,11.08 IC6.P$20
N$8
  Top 0.254: RN2.8 36.76,17.85 42.73,11.88 IC6.P$19
N$9
  Top 0.254: IC6.P$18 43.2,12.68 37.53,18.34 RN3.5
N$10
  Top 0.254: IC6.P$17 43.67,13.47 38.34,18.81 RN3.6
N$11
  Top 0.254: IC6.P$16 44.15,14.28 39.13,19.29 RN3.7
N$12
  Top 0.254: IC6.P$15 46.6,15.08 46.33,14.81 44.78,14.81 39.94,19.65 RN3.8
N$13
  Top 0.254: IC6.P$13 44.28,16.67 40.71,20.25 RN4.5
N$14
  Top 0.254: IC6.P$11 46.6,18.27 46.46,18.41 44.86,18.41 41.51,21.76 RN4.6
N$15
  Top 0.254: IC6.P$10 45.7,19.07 42.31,22.46 RN4.7
N$16
  Top 0.254: IC6.P$8 45.37,20.67 43.11,22.93 RN4.8
N$17
  Top 0.254: IC6.P$7 45.84,21.47 43.88,23.42 RN5.5
N$18
  Top 0.254: IC6.P$5 46.45,23.07 44.69,24.83 RN5.6
N$19
  Top 0.254: IC6.P$4 46.61,23.88 45.48,25 RN5.7
N$20
  Top 0.254: IC6.P$2 46.91,25.47 46.28,26.1 RN5.8
N$21
  Top 0.254: IC6.P$53 59.77,25.47 60.4,26.1 RN6.1
N$22
  Top 0.254: IC6.P$51 60.22,23.88 61.2,24.85 RN6.2
N$23
  Top 0.254: IC6.P$50 60.44,23.07 62,24.64 62,31.7 RN6.3
N$24
  Top 0.254: IC6.P$48 59.05,21.46 60.27,21.46 62.8,23.98 RN6.4
N$25
  Top 0.254: IC6.P$47 61.06,20.68 63.57,23.18 RN7.1
N$26
  Top 0.254: IC6.P$45 | IC6.P$45 60.35,19.07 64.37,23.09 RN7.2
N$27
  Top 0.254: IC6.P$44 59.05,18.26 60.05,18.26 60.2,18.41 60.86,18.41 65.17,22.73 RN7.3
N$28
  Top 0.254: IC6.P$42 61.91,16.67 65.97,20.73 RN7.4
N$29
  Top 0.254: RN8.1 66.75,19.98 61.04,14.28 IC6.P$39 | IC6.P$39
N$30
  Top 0.254: RN8.2 67.55,20.02 61,13.47 IC6.P$38
N$31
  Top 0.254: RN8.3 68.34,20.08 60.94,12.68 IC6.P$37 | IC6.P$37
N$32
  Top 0.254: IC6.P$35 60.2,11.07 69.14,20.02 RN8.4
N$33
  Top 0.254: IC6.P$34 60.29,10.28 69.92,19.91 RN9.1
N$34
  Top 0.254: IC6.P$33 60.3,9.47 70.72,19.89 RN9.2
N$35
  Top 0.254: IC6.P$32 60.29,8.68 71.52,19.91 RN9.3
N$36
  Top 0.254: IC6.P$31 60.38,7.87 72.32,19.82 RN9.4
N$37
  Top 0.254: IC6.P$30 60.36,7.08 73.09,19.81 RN10.1
N$38
  Top 0.254: IC6.P$29 60.5,6.27 73.89,19.67 RN10.2
N$39
  Top 0.406: IC10.P$3 69.02,13.14 74.93,19.05 R4.2
N$42
  Top 0.254: ACT.1 R7.2
R/W
  Top 0.254: IC2.102 28.81,40.61 28.42,41 23.85,41 22.23,39.37 22.23,25.4 IC1.9
  Top 0.813: IC1.9 IC9.9
ROM_B0
  Top 0.254: IC8.3 34.92,76.83 34.29,76.2 34.29,65.41 36.83,62.87 36.83,60.96 37.7,60.09 IC2.68
ROM_B1
  Top 0.254: IC2.69 37.2,59.96 36.2,60.96 36.2,62.87 33.66,65.41 33.66,76.83 34.92,78.1 IC8.2
ROM_B2
  Top 0.254: IC8.1 35.56,79.38 33.02,76.83 33.02,65.41 35.56,62.87 35.56,60.96 36.7,59.82 IC2.70
ROM_B3
  Top 0.254: IC2.71 36.2,59.69 34.92,60.96 34.92,62.87 32.38,65.41 32.38,77.47 29.84,80.01 29.84,83.18 30.48,83.82 32.38,83.82 33.02,83.18 IC8.30
ROM_OE
  Top 0.254: IC8.24 44.45,85.72 45.09,86.36 46,86.36 46.35,86 46.35,79.38 47.62,78.1 47.62,76.2 48.9,74.93 53.34,74.93 53.98,74.3 53.98,73.41 53.34,72.77 50.55,72.77 50.16,72.39 50.16,66.67 56.52,60.33 56.52,54.89 56.23,54.61 IC2.35
ROM_WE
  Top 0.254: IC8.31 38.1,81.91 38.73,82.55 38.73,86.36 39.37,86.99 47.3,86.99 47.62,86.66 47.62,78.74 48.26,78.1 48.26,76.83 48.9,76.2 54.61,76.2 55.24,75.56 55.24,73.56 53.95,72.26 51.21,72.26 50.8,71.86 50.8,67.31 57.15,60.96 57.15,54.61 56.65,54.11 IC2.34
TCK  (via drill 0.3)
  Top 0.254: v37.47,62.23 37.47,60.96 38.2,60.23 IC2.67 | RN11.1 62.75,83.71 64.14,85.09 SV2.9
  Bottom 0.254: SV2.9 63.2,86.66 50.27,86.66 45.09,81.48 45.09,66.04 44.45,65.41 40.01,65.41 37.47,62.87 v37.47,62.23
TDI  (via drill 0.3)
  Top 0.254: v40.49,61.11 40.2,60.83 IC2.63 | v50.8,85.09 52.38,86.66 58.12,86.66 SV2.5 60.53,84.24 RN11.3
  Bottom 0.254: v40.49,61.11 40.49,63.35 41.27,64.13 44.45,64.13 46.35,66.04 46.35,81.28 50.16,85.09 v50.8,85.09
TDO  (via drill 0.3)
  Top 0.254: SV2.3 56.11,86.13 53.11,86.13 v51.44,84.45 | IC2.122 42.2,37.76 v42.55,38.1
  Bottom 0.254: v51.44,84.45 50.16,84.45 46.99,81.28 46.99,59.69 46.35,59.05 46.35,41.91 v42.55,38.1
TMS  (via drill 0.3)
  Top 0.254: v39.09,61.57 39.2,61.46 IC2.65 | RN11.2 61.34,84.19 SV2.7
  Bottom 0.254: SV2.7 61.19,86.13 50.39,86.13 45.72,81.46 45.72,66.04 44.45,64.77 40.01,64.77 39.09,63.86 v39.09,61.57
UDQM
  Top 0.254: IC2.11 58.11,42.61 66.75,33.97 RN8.8
VCC-X
  Top 0.406: R1.1 66.89,8.23 C19.1 68.97,6.99 IC10.P$4
VMA
  Top 0.813: IC1.19 IC9.19
VPA
  Top 0.813: IC1.21 IC9.21

### Text on the board
Top: TOP
Bottom: BOT
tNames: - + | CDTV-IDE-RAM V0.5 / (C) Matthias Heinrichs 2015